# EAGLE schematic motherboard_schematic_ver_1_0 (EAGLE 7.5.0)

## Sheet 1 of 9
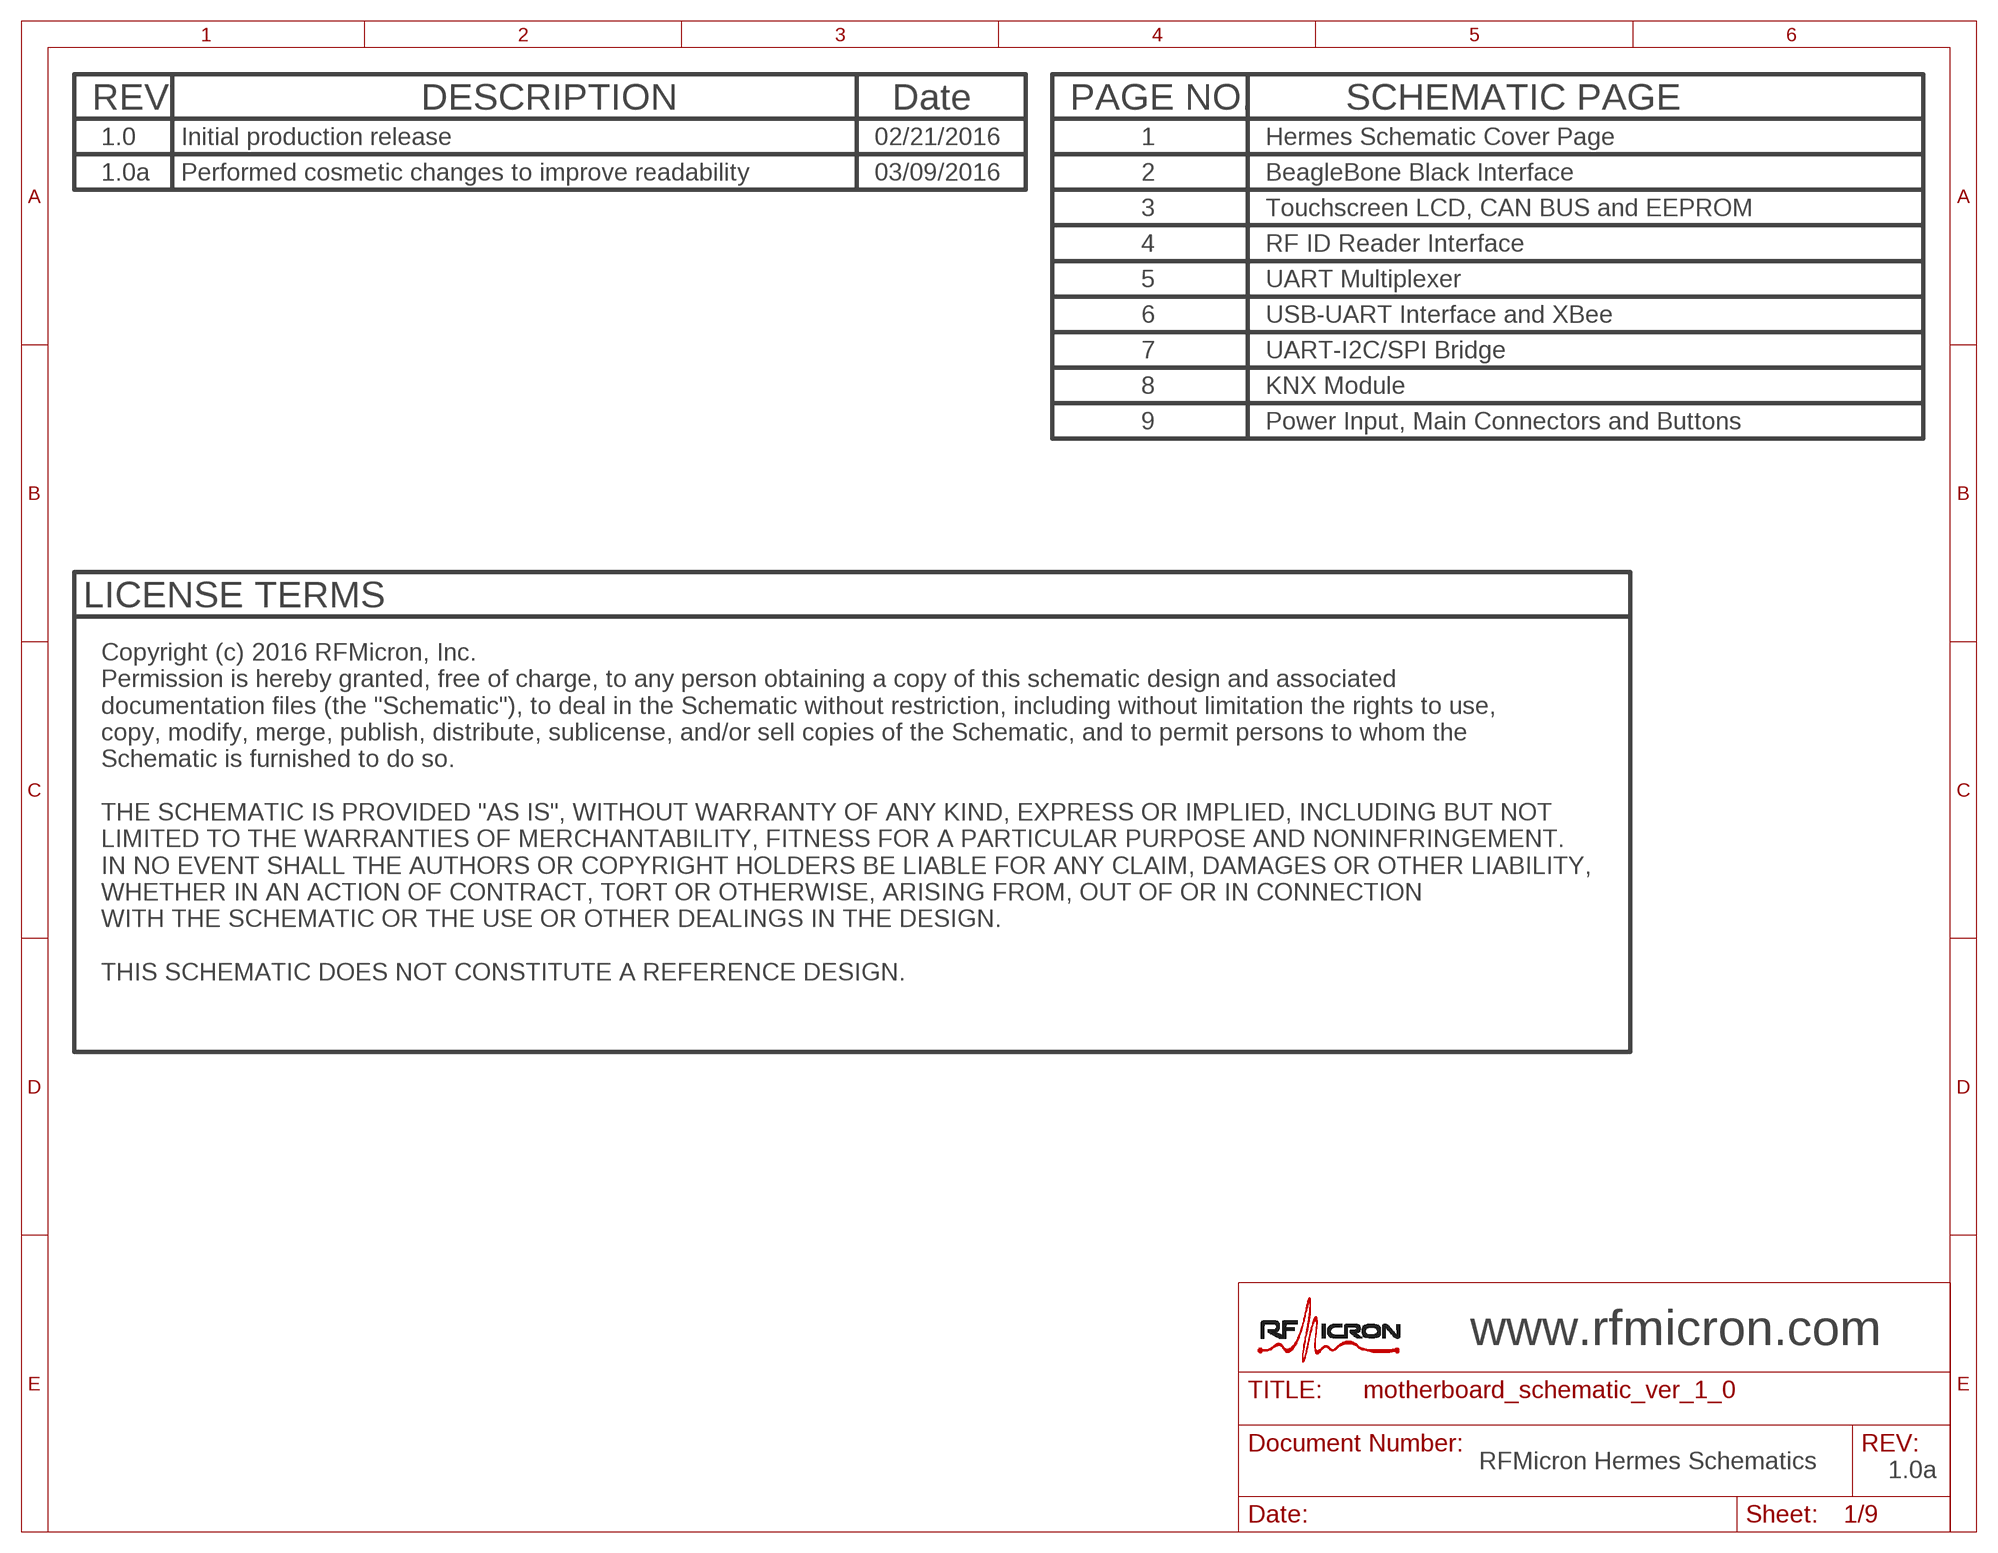
[diagram p0: schematic, sheet 1]

### Notes on the sheet
- REV | DESCRIPTION | Date | PAGE NO. | SCHEMATIC PAGE
- 1.0 | Initial production release | 02/21/2016 | 1 | Hermes Schematic Cover Page
- Performed cosmetic changes to improve readability
- 1.0a | 03/09/2016 | 2 | BeagleBone Black Interface
- 3 | Touchscreen LCD, CAN BUS and EEPROM
- 4 | RF ID Reader Interface
- 5 | UART Multiplexer
- 6 | USB-UART Interface and XBee
- 7 | UART-I2C/SPI Bridge
- 8 | KNX Module
- 9 | Power Input, Main Connectors and Buttons
- LICENSE TERMS
- Copyright (c) 2016 RFMicron, Inc. 
  Permission is hereby granted, free of charge, to any person obtaining a copy of this schematic design and associated
  documentation files (the "Schematic"), to deal in the Schematic without restriction, including without limitation the rights to use, 
  copy, modify, merge, publish, distribute, sublicense, and/or sell copies of the Schematic, and to permit persons to whom the 
  Schematic is furnished to do so.
  
  THE SCHEMATIC IS PROVIDED "AS IS", WITHOUT WARRANTY OF ANY KIND, EXPRESS OR IMPLIED, INCLUDING BUT NOT 
  LIMITED TO THE WARRANTIES OF MERCHANTABILITY, FITNESS FOR A PARTICULAR PURPOSE AND NONINFRINGEMENT. 
  IN NO EVENT SHALL THE AUTHORS OR COPYRIGHT HOLDERS BE LIABLE FOR ANY CLAIM, DAMAGES OR OTHER LIABILITY, 
  WHETHER IN AN ACTION OF CONTRACT, TORT OR OTHERWISE, ARISING FROM, OUT OF OR IN CONNECTION 
  WITH THE SCHEMATIC OR THE USE OR OTHER DEALINGS IN THE DESIGN.
  
  THIS SCHEMATIC DOES NOT CONSTITUTE A REFERENCE DESIGN.
- www.rfmicron.com
- RFMicron Hermes Schematics
- 1.0a

## Sheet 2 of 9
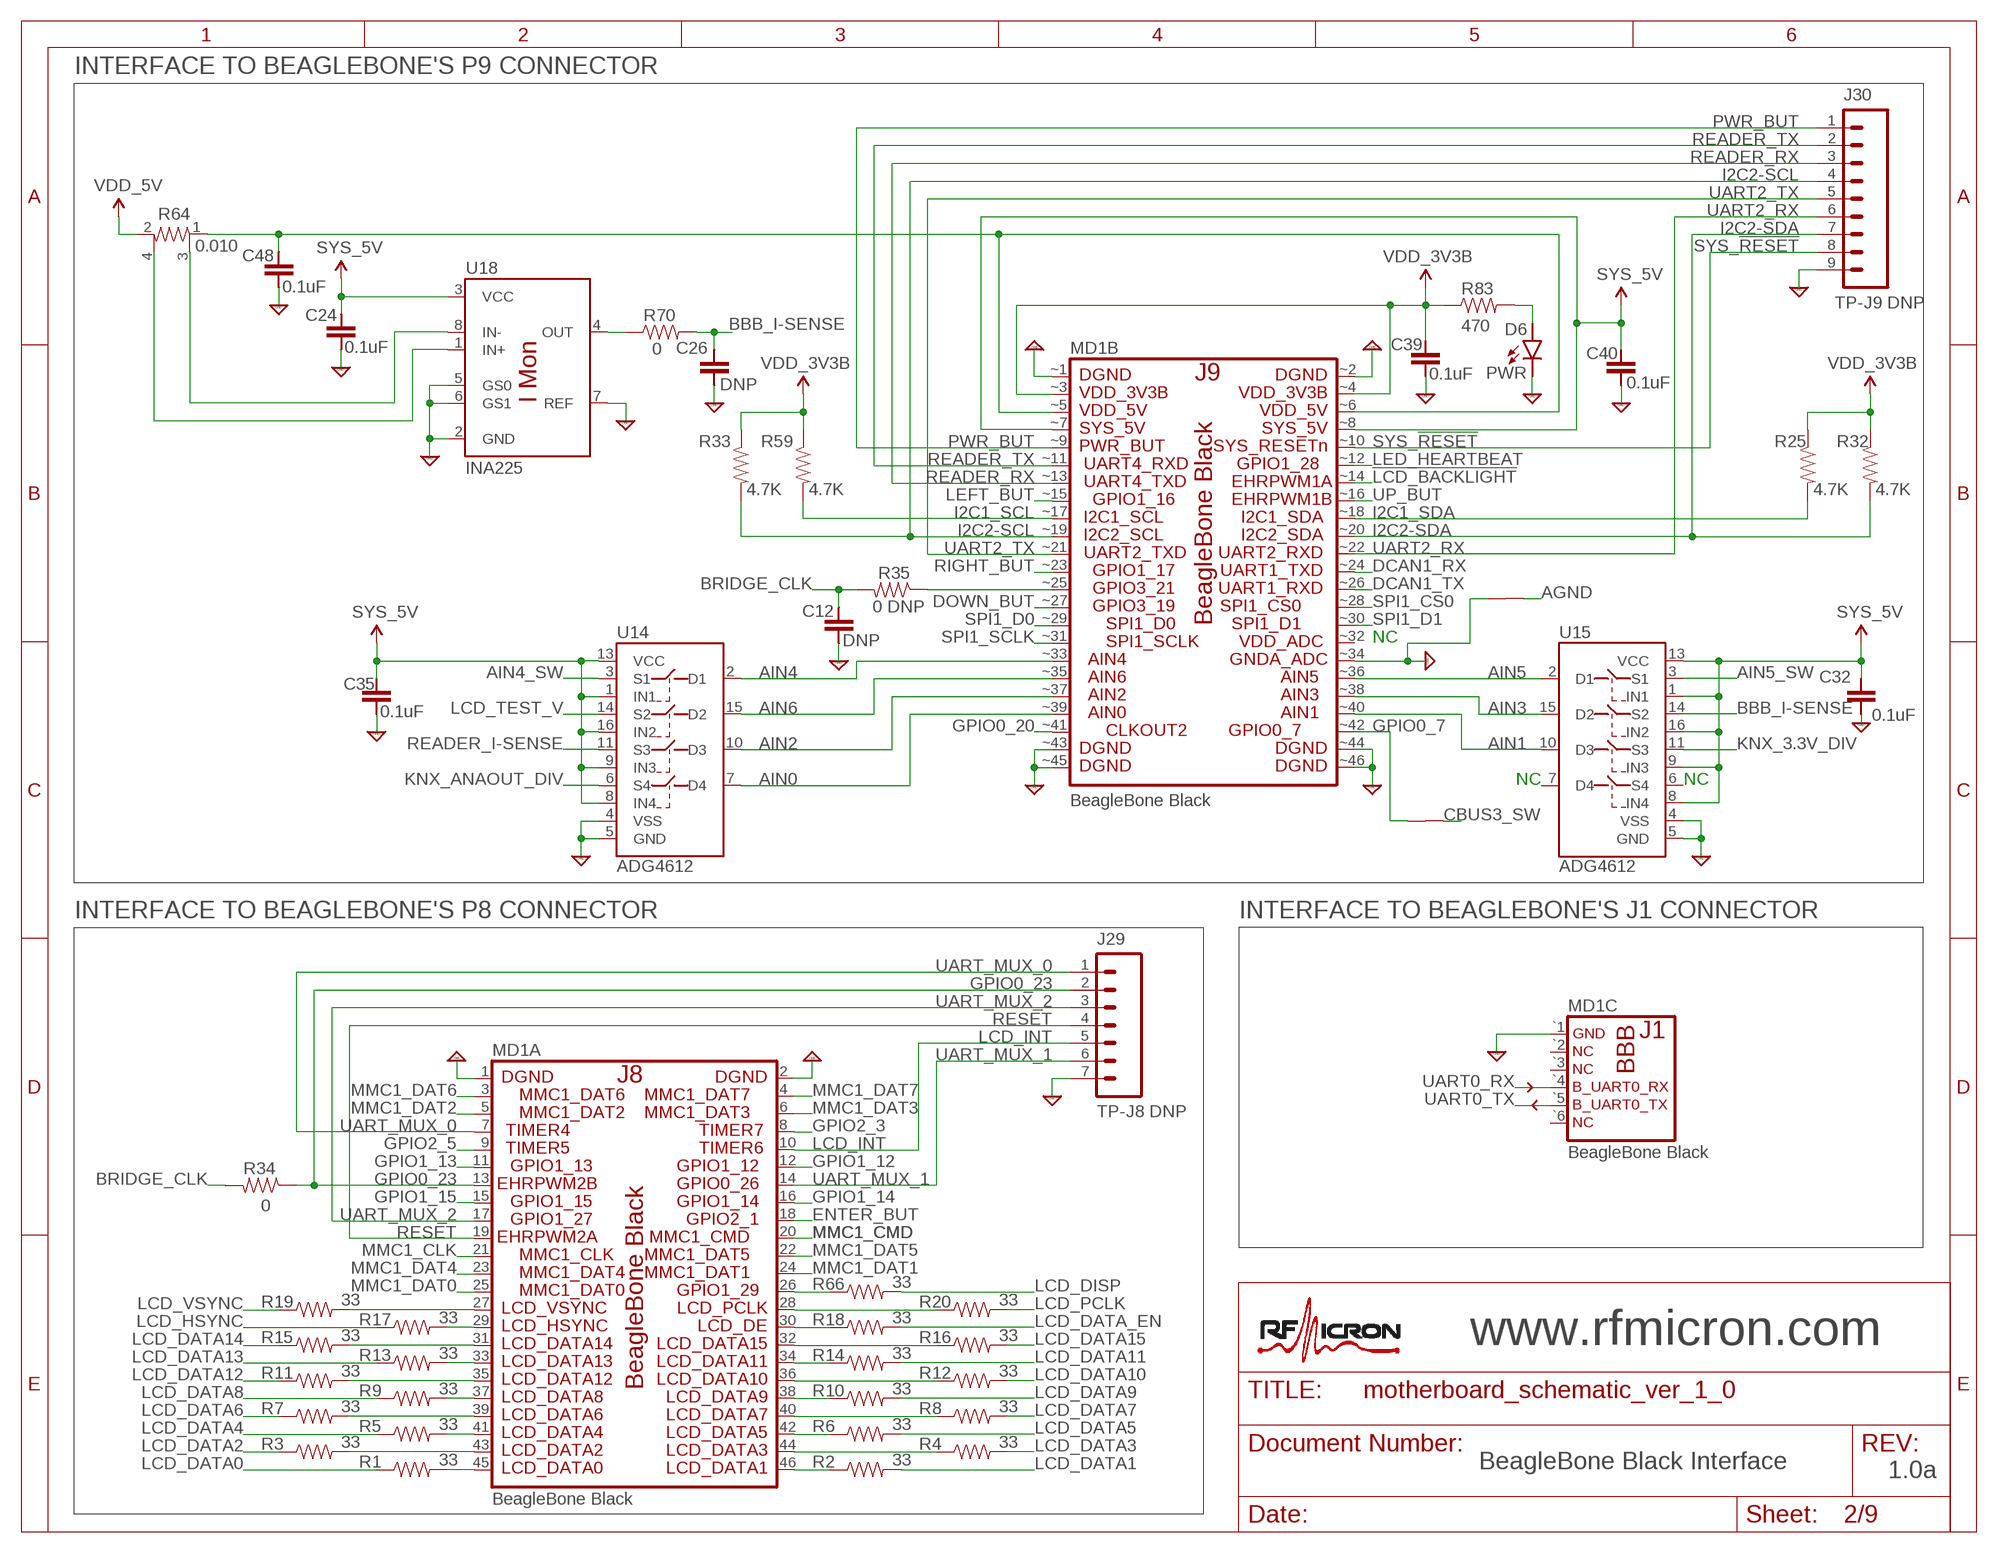
[diagram p1: schematic, sheet 2]

### Parts
C12  DNP  CAP0603  [0603-CAP]
C24  0.1uF  CAP0603  [0603-CAP]
C26  DNP  CAP0603  [0603-CAP]
C32  0.1uF  CAP0603  [0603-CAP]
C35  0.1uF  CAP0603  [0603-CAP]
C39  0.1uF  CAP0603  [0603-CAP]
C40  0.1uF  CAP0603  [0603-CAP]
C48  0.1uF  CAP0603  [0603-CAP]
D6  PWR  LED1206  [LED-1206]
E1  NAMECHANGE  [NAMECHANGE]
E8  NAMECHANGE  [NAMECHANGE]
J29  TP-J8 DNP  M07SP  [1X07-SPECIAL]
J30  TP-J9 DNP  M09SPECIAL  [1X09-SPECIAL]
MD1  BeagleBone Black  BBONE_BKBOT_UP  [BBONE_BK]
R1  33  RESISTOR0603  [0603-RES]
R2  33  RESISTOR0603  [0603-RES]
R3  33  RESISTOR0603  [0603-RES]
R4  33  RESISTOR0603  [0603-RES]
R5  33  RESISTOR0603  [0603-RES]
R6  33  RESISTOR0603  [0603-RES]
R7  33  RESISTOR0603  [0603-RES]
R8  33  RESISTOR0603  [0603-RES]
R9  33  RESISTOR0603  [0603-RES]
R10  33  RESISTOR0603  [0603-RES]
R11  33  RESISTOR0603  [0603-RES]
R12  33  RESISTOR0603  [0603-RES]
R13  33  RESISTOR0603  [0603-RES]
R14  33  RESISTOR0603  [0603-RES]
R15  33  RESISTOR0603  [0603-RES]
R16  33  RESISTOR0603  [0603-RES]
R17  33  RESISTOR0603  [0603-RES]
R18  33  RESISTOR0603  [0603-RES]
R19  33  RESISTOR0603  [0603-RES]
R20  33  RESISTOR0603  [0603-RES]
R25  4.7K  RESISTOR0603  [0603-RES]
R32  4.7K  RESISTOR0603  [0603-RES]
R33  4.7K  RESISTOR0603  [0603-RES]
R34  0  RESISTOR0603  [0603-RES]
R35  0 DNP  RESISTOR0603  [0603-RES]
R59  4.7K  RESISTOR0603  [0603-RES]
R64  0.010  RESISTOR_4-TERM1  [RESIST_4-TERM_VISHAY]
R66  33  RESISTOR0603  [0603-RES]
R70  0  RESISTOR0603  [0603-RES]
R83  470  RESISTOR0603  [0603-RES]
U14  ADG4612  [TSSOP16]
U15  ADG4612  [TSSOP16]
U18  INA225  [MSOP8]

### Nets
!LCD_BACKLIGHT: MD1.~14 ; also sheet 3
AGND: E1.2 ; also sheet 9
AIN0: MD1.~39 U14.7(D4)
AIN1: MD1.~40 U15.10(D3)
AIN2: MD1.~37 U14.10(D3)
AIN3: MD1.~38 U15.15(D2)
AIN4: MD1.~33 U14.2(D1)
AIN4_SW: U14.3(S1) ; also sheet 9
AIN5: MD1.~36 U15.2(D1)
AIN5_SW: U15.3(S1) ; also sheet 9
AIN6: MD1.~35 U14.15(D2)
BBB_I-SENSE: C26.1(+) R70.2 U15.14(S2)
BBB_I-SENSE+: R64.4 U18.1(IN+)
BBB_I-SENSE-: R64.3 U18.8(IN-)
BRIDGE_CLK: C12.1(+) R34.2 R35.2 ; also sheet 7
CBUS3_SW: E8.1 ; also sheet 6
DCAN1_RX: MD1.~24 ; also sheet 3,9
DCAN1_TX: MD1.~26 ; also sheet 3,9
DOWN_BUT: MD1.~27 ; also sheet 9
ENTER_BUT: MD1.18 ; also sheet 9
GND: C12.2(-) C24.1(+) C26.2(-) C32.2(-) C35.2(-) C39.2(-) C40.2(-) C48.2(-) D6.C E1.1 J29.7 J30.9 MD1.1 MD1.2 MD1.`1 MD1.~1 MD1.~2 MD1.~34 MD1.~43 MD1.~44 MD1.~45 MD1.~46 U14.4(VSS) U14.5(GND) U15.4(VSS) U15.5(GND) U18.2(GND) U18.5(GS0) U18.6(GS1) U18.7(REF) ; also sheet 3,4,5,6,7,8,9
GPIO0_7: E8.2 MD1.~42 ; also sheet 4,9
GPIO0_20: MD1.~41 ; also sheet 6,9
GPIO0_23: J29.2 MD1.13 R34.1
GPIO1_12: MD1.12 ; also sheet 3,9
GPIO1_13: MD1.11 ; also sheet 3,7,9
GPIO1_14: MD1.16 ; also sheet 8,9
GPIO1_15: MD1.15 ; also sheet 8,9
GPIO2_3: MD1.8 ; also sheet 6,9
GPIO2_5: MD1.9 ; also sheet 3,9
I2C1_SCL: MD1.~17 R59.2 ; also sheet 7,9
I2C1_SDA: MD1.~18 R25.2 ; also sheet 7,9
I2C2-SCL: J30.4 MD1.~19 R33.2 ; also sheet 3
I2C2-SDA: J30.7 MD1.~20 R32.2 ; also sheet 3
KNX_3.3V_DIV: U15.11(S3) ; also sheet 8
KNX_ANAOUT_DIV: U14.6(S4) ; also sheet 8
LCD_DATA0: R1.1 ; also sheet 3
LCD_DATA1: R2.2 ; also sheet 3
LCD_DATA2: R3.1 ; also sheet 3
LCD_DATA3: R4.2 ; also sheet 3
LCD_DATA4: R5.1 ; also sheet 3
LCD_DATA5: R6.2 ; also sheet 3
LCD_DATA6: R7.1 ; also sheet 3
LCD_DATA7: R8.2 ; also sheet 3
LCD_DATA8: R9.1 ; also sheet 3
LCD_DATA9: R10.2 ; also sheet 3
LCD_DATA10: R12.2 ; also sheet 3
LCD_DATA11: R14.2 ; also sheet 3
LCD_DATA12: R11.1 ; also sheet 3
LCD_DATA13: R13.1 ; also sheet 3
LCD_DATA14: R15.1 ; also sheet 3
LCD_DATA15: R16.2 ; also sheet 3
LCD_DATA_EN: R18.2 ; also sheet 3
LCD_DISP: R66.2 ; also sheet 3
LCD_HSYNC: R17.1 ; also sheet 3
LCD_INT: J29.5 MD1.10 ; also sheet 3
LCD_PCLK: R20.2 ; also sheet 3
LCD_TEST_V: U14.14(S2) ; also sheet 3
LCD_VSYNC: R19.1 ; also sheet 3
LED_HEARTBEAT: MD1.~12 ; also sheet 9
LEFT_BUT: MD1.~15 ; also sheet 9
MMC1_CLK: MD1.21 ; also sheet 9
MMC1_CMD: MD1.20 ; also sheet 9
MMC1_DAT0: MD1.25 ; also sheet 9
MMC1_DAT1: MD1.24 ; also sheet 9
MMC1_DAT2: MD1.5 ; also sheet 9
MMC1_DAT3: MD1.6 ; also sheet 9
MMC1_DAT4: MD1.23 ; also sheet 9
MMC1_DAT5: MD1.22 ; also sheet 9
MMC1_DAT6: MD1.3 ; also sheet 9
MMC1_DAT7: MD1.4 ; also sheet 9
N$1: MD1.46 R2.1
N$2: MD1.44 R4.1
N$3: MD1.42 R6.1
N$4: MD1.40 R8.1
N$5: MD1.38 R10.1
N$6: MD1.36 R12.1
N$7: MD1.34 R14.1
N$8: MD1.32 R16.1
N$9: MD1.30 R18.1
N$10: MD1.28 R20.1
N$11: MD1.45 R1.2
N$12: MD1.43 R3.2
N$13: MD1.41 R5.2
N$14: MD1.39 R7.2
N$15: MD1.37 R9.2
N$16: MD1.35 R11.2
N$17: MD1.33 R13.2
N$18: MD1.31 R15.2
N$19: MD1.29 R17.2
N$20: MD1.27 R19.2
N$36: MD1.26 R66.1
N$78: MD1.~25 R35.1
N$98: R70.1 U18.4(OUT)
N$101: D6.A R83.2
PWR_BUT: J30.1 MD1.~9 ; also sheet 9
READER_I-SENSE: U14.11(S3) ; also sheet 4
READER_RX: J30.3 MD1.~13 ; also sheet 4,9
READER_TX: J30.2 MD1.~11 ; also sheet 4,9
RESET: J29.4 MD1.19 ; also sheet 6,7
RIGHT_BUT: MD1.~23 ; also sheet 9
SPI1_CS0: MD1.~28 ; also sheet 9
SPI1_D0: MD1.~29 ; also sheet 9
SPI1_D1: MD1.~30 ; also sheet 9
SPI1_SCLK: MD1.~31 ; also sheet 9
SYS_5V: C24.2(-) C32.1(+) C35.1(+) C40.1(+) MD1.~7 MD1.~8 U14.1(IN1) U14.8(IN4) U14.9(IN3) U14.13(VCC) U14.16(IN2) U15.1(IN1) U15.8(IN4) U15.9(IN3) U15.13(VCC) U15.16(IN2) U18.3(VCC) ; also sheet 3,4,9
SYS_!RESET: J30.8 MD1.~10 ; also sheet 9
UART0_RX: MD1.`4 ; also sheet 6
UART0_TX: MD1.`5 ; also sheet 6
UART2_RX: J30.6 MD1.~22 ; also sheet 5
UART2_TX: J30.5 MD1.~21 ; also sheet 5
UART_MUX_0: J29.1 MD1.7 ; also sheet 5
UART_MUX_1: J29.6 MD1.14 ; also sheet 5
UART_MUX_2: J29.3 MD1.17 ; also sheet 5
UP_BUT: MD1.~16 ; also sheet 9
VDD_3V3B: C39.1(+) MD1.~3 MD1.~4 R25.1 R32.1 R33.1 R59.1 R83.1 ; also sheet 3,4,5,6,7,8,9
VDD_5V: R64.2 ; also sheet 4,9
VDD_5V`: C48.1(+) MD1.~5 MD1.~6 R64.1
Unconnected: MD1.`2 MD1.`3 MD1.`6 MD1.~32 U15.6(S4) U15.7(D4)

### Notes on the sheet
- INTERFACE TO BEAGLEBONE'S P9 CONNECTOR
- NC
- NC | NC
- INTERFACE TO BEAGLEBONE'S P8 CONNECTOR | INTERFACE TO BEAGLEBONE'S J1 CONNECTOR
- www.rfmicron.com
- BeagleBone Black Interface
- 1.0a

## Sheet 3 of 9
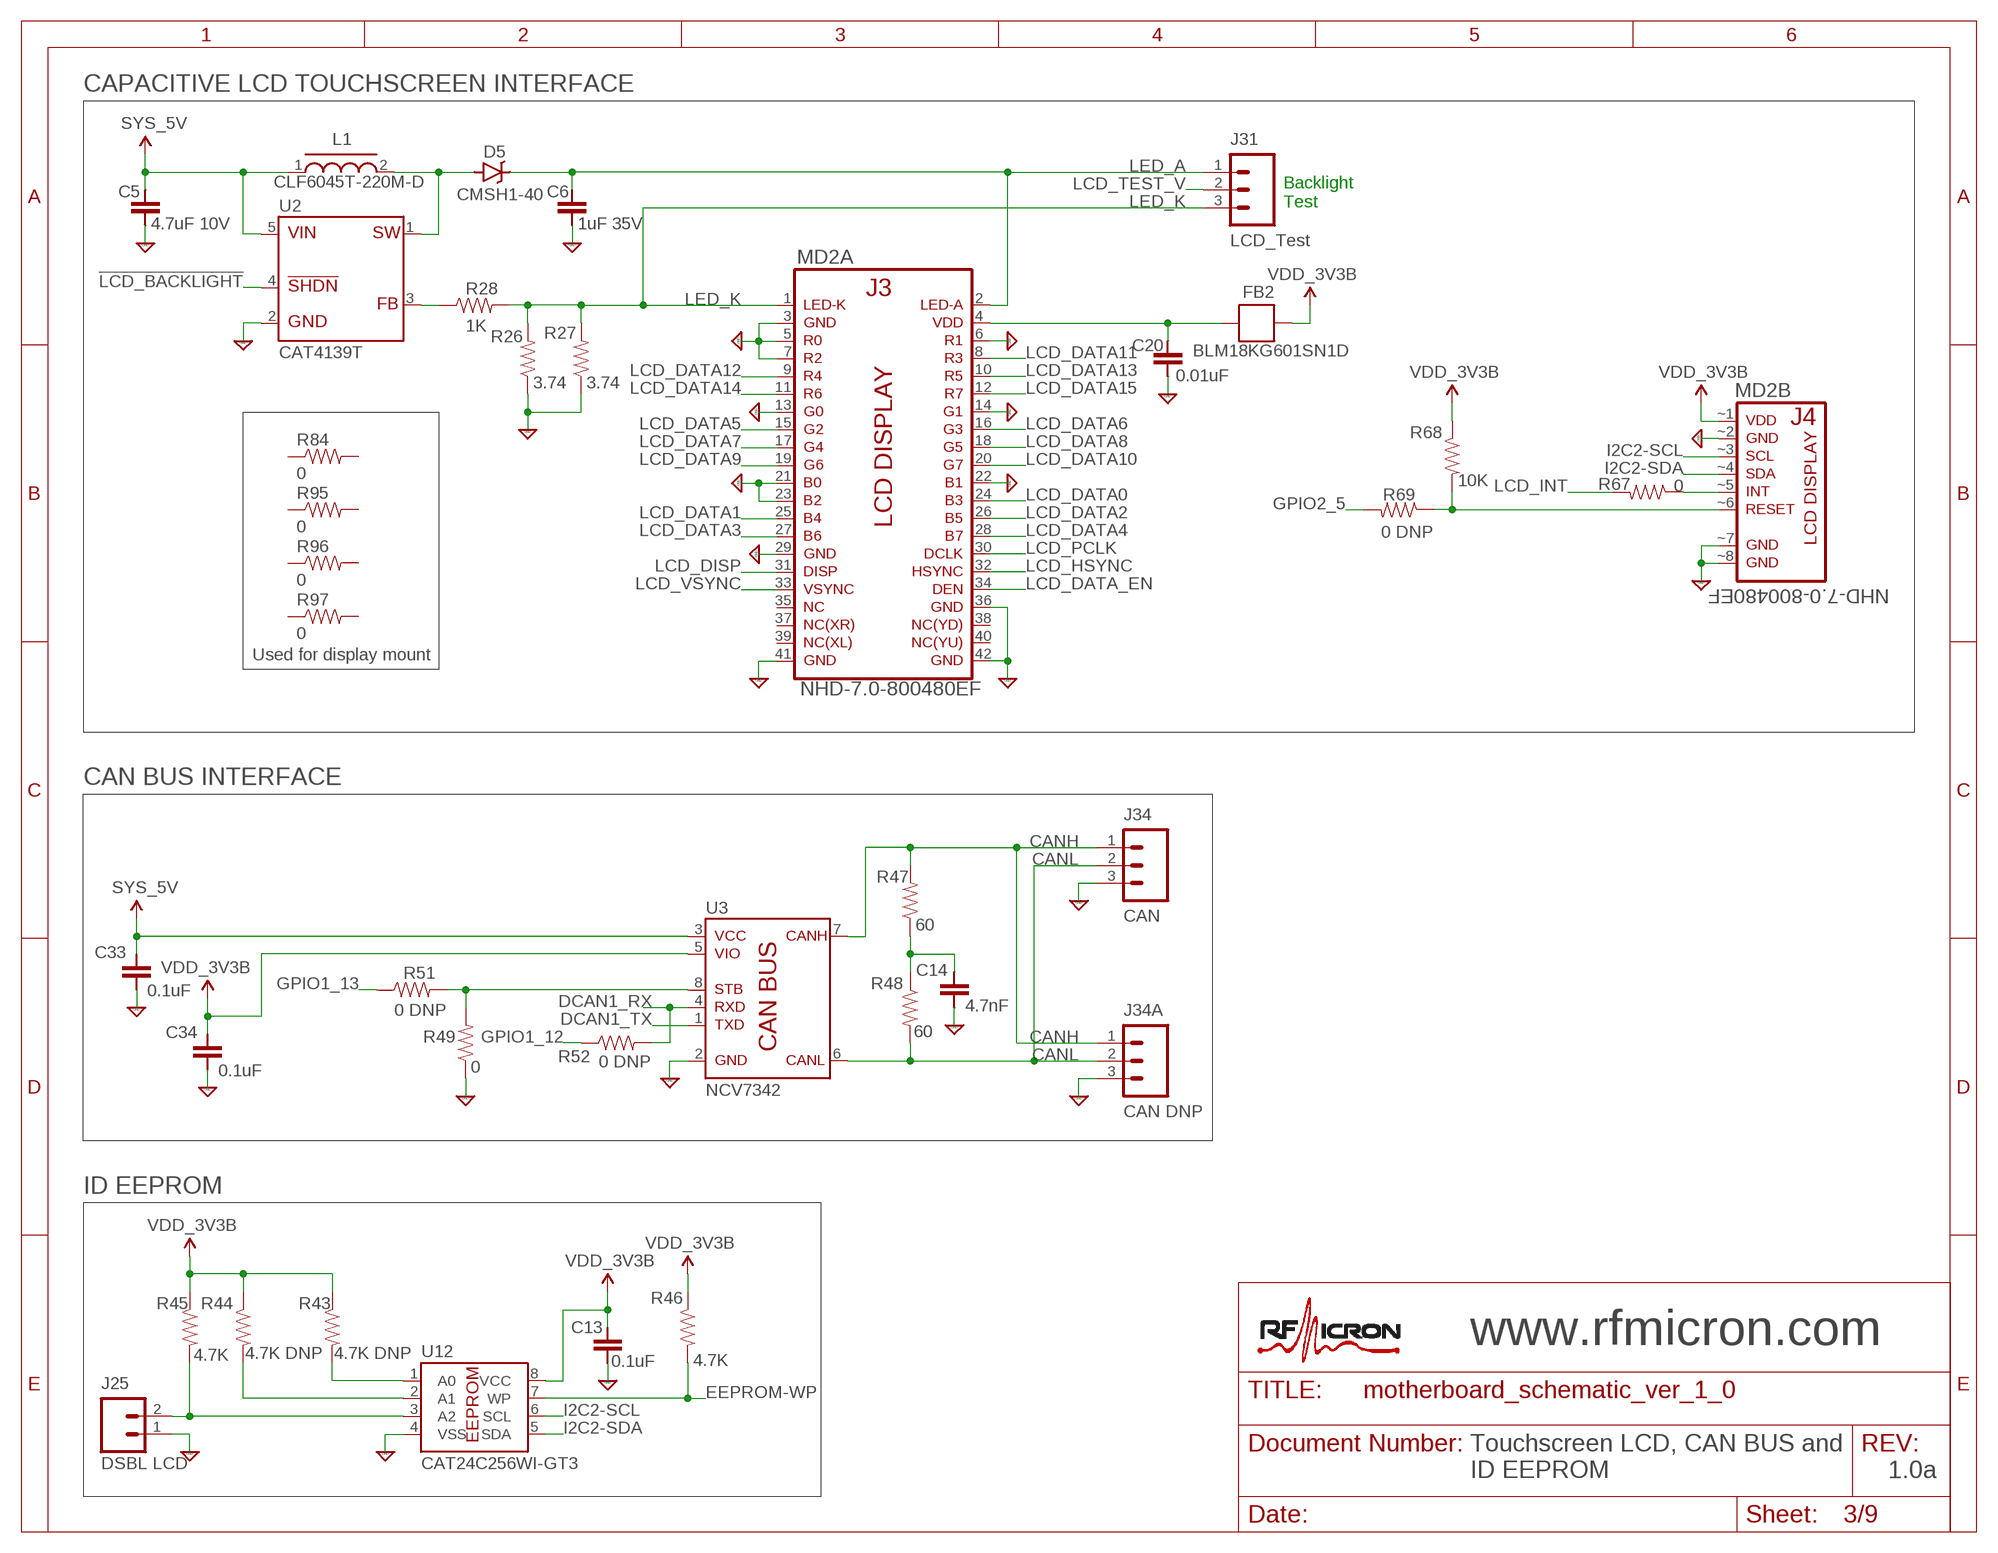
[diagram p2: schematic, sheet 3]

### Parts
C5  4.7uF 10V  CAP0603  [0603-CAP]
C6  1uF 35V  CAP0603  [0603-CAP]
C13  0.1uF  CAP0603  [0603-CAP]
C14  4.7nF  CAP0603  [0603-CAP]
C20  0.01uF  CAP0603  [0603-CAP]
C33  0.1uF  CAP0603  [0603-CAP]
C34  0.1uF  CAP0603  [0603-CAP]
D5  CMSH1-40  DIODE-SCHOTTKY1  [SMB-DIODE]
FB2  BLM18KG601SN1D  FERRITEBEAD  [0603]
J25  DSBL LCD  M02ASM  [1X2SM]
J31  LCD_Test  M03SP  [1X03-SPECIAL]
J34  CAN  M03PH  [PHOENIX1725669-3]
J34A  CAN DNP  M03SP  [1X03-SPECIAL]
L1  CLF6045T-220M-D  TDK-CA_INDUCT  [TDK_CA]
MD2  NHD-7.0-800480EF  NEWHAVEN_LCD_NHD-7.0-800480EF  [NEWHAVEN_LCD_NHD-7.0-800480EF]
R26  3.74  RESISTOR0603  [0603-RES]
R27  3.74  RESISTOR0603  [0603-RES]
R28  1K  RESISTOR0603  [0603-RES]
R43  4.7K DNP  RESISTOR0603  [0603-RES]
R44  4.7K DNP  RESISTOR0603  [0603-RES]
R45  4.7K  RESISTOR0603  [0603-RES]
R46  4.7K  RESISTOR0603  [0603-RES]
R47  60  RESISTOR0603  [0603-RES]
R48  60  RESISTOR0603  [0603-RES]
R49  0  RESISTOR0603  [0603-RES]
R51  0 DNP  RESISTOR0603  [0603-RES]
R52  0 DNP  RESISTOR0603  [0603-RES]
R67  0  RESISTOR0603  [0603-RES]
R68  10K  RESISTOR0603  [0603-RES]
R69  0 DNP  RESISTOR0603  [0603-RES]
R84  0  RESISTOR0805  [0805-RES]
R95  0  RESISTOR0805  [0805-RES]
R96  0  RESISTOR0805  [0805-RES]
R97  0  RESISTOR0805  [0805-RES]
U2  CAT4139T  [TSOT-23-5]
U3  NCV7342  [SOIC08]
U12  CAT24C256WI-GT3  EEPROM-I2CSMD  [SO08]

### Nets
!LCD_BACKLIGHT: U2.4(!SHDN) ; also sheet 2
CANH: J34.1 J34A.1 R47.2 U3.7(CANH)
CANL: J34.2 J34A.2 R48.2 U3.6(CANL)
DCAN1_RX: R52.2 U3.4(RXD) ; also sheet 2,9
DCAN1_TX: U3.1(TXD) ; also sheet 2,9
EEPROM-WP: R46.2 U12.7(WP) ; also sheet 9
GND: C5.2(-) C6.2(-) C13.2(-) C14.2(-) C20.2(-) C33.2(-) C34.2(-) J25.1 J34.3 J34A.3 MD2.3 MD2.5 MD2.6 MD2.7 MD2.13 MD2.14 MD2.21 MD2.22 MD2.23 MD2.29 MD2.36 MD2.41 MD2.42 MD2.~2 MD2.~7 MD2.~8 R26.1 R27.1 R49.1 U2.2(GND) U3.2(GND) U12.4(VSS) ; also sheet 2,4,5,6,7,8,9
GPIO1_12: R52.1 ; also sheet 2,9
GPIO1_13: R51.1 ; also sheet 2,7,9
GPIO2_5: R69.2 ; also sheet 2,9
I2C2-SCL: MD2.~3 U12.6(SCL) ; also sheet 2
I2C2-SDA: MD2.~4 U12.5(SDA) ; also sheet 2
LCD_DATA0: MD2.24 ; also sheet 2
LCD_DATA1: MD2.25 ; also sheet 2
LCD_DATA2: MD2.26 ; also sheet 2
LCD_DATA3: MD2.27 ; also sheet 2
LCD_DATA4: MD2.28 ; also sheet 2
LCD_DATA5: MD2.15 ; also sheet 2
LCD_DATA6: MD2.16 ; also sheet 2
LCD_DATA7: MD2.17 ; also sheet 2
LCD_DATA8: MD2.18 ; also sheet 2
LCD_DATA9: MD2.19 ; also sheet 2
LCD_DATA10: MD2.20 ; also sheet 2
LCD_DATA11: MD2.8 ; also sheet 2
LCD_DATA12: MD2.9 ; also sheet 2
LCD_DATA13: MD2.10 ; also sheet 2
LCD_DATA14: MD2.11 ; also sheet 2
LCD_DATA15: MD2.12 ; also sheet 2
LCD_DATA_EN: MD2.34 ; also sheet 2
LCD_DISP: MD2.31 ; also sheet 2
LCD_HSYNC: MD2.32 ; also sheet 2
LCD_INT: R67.2 ; also sheet 2
LCD_PCLK: MD2.30 ; also sheet 2
LCD_TEST_V: J31.2 ; also sheet 2
LCD_VSYNC: MD2.33 ; also sheet 2
LED_A: C6.1(+) D5.C J31.1 MD2.2
LED_K: J31.3 MD2.1 R26.2 R27.2 R28.2
N$34: R43.2 U12.1(A0)
N$37: D5.A L1.2 U2.1(SW)
N$38: R44.2 U12.2(A1)
N$39: J25.2 R45.2 U12.3(A2)
N$41: R28.1 U2.3(FB)
N$48: C14.1(+) R47.1 R48.1
N$84: R49.2 R51.2 U3.8(STB)
N$93: C20.1(+) FB2.2 MD2.4
N$95: MD2.~6 R68.2 R69.1
N$97: MD2.~5 R67.1
SYS_5V: C5.1(+) C33.1(+) L1.1 U2.5(VIN) U3.3(VCC) ; also sheet 2,4,9
VDD_3V3B: C13.1(+) C34.1(+) FB2.1 MD2.~1 R43.1 R44.1 R45.1 R46.1 R68.1 U3.5(VIO) U12.8(VCC) ; also sheet 2,4,5,6,7,8,9
Unconnected: MD2.35 MD2.37 MD2.38 MD2.39 MD2.40 R84.1 R84.2 R95.1 R95.2 R96.1 R96.2 R97.1 R97.2

### Notes on the sheet
- CAPACITIVE LCD TOUCHSCREEN INTERFACE
- Backlight
  Test
- Used for display mount
- CAN BUS INTERFACE
- ID EEPROM
- www.rfmicron.com
- Touchscreen LCD, CAN BUS and 
  ID EEPROM
- 1.0a

## Sheet 4 of 9
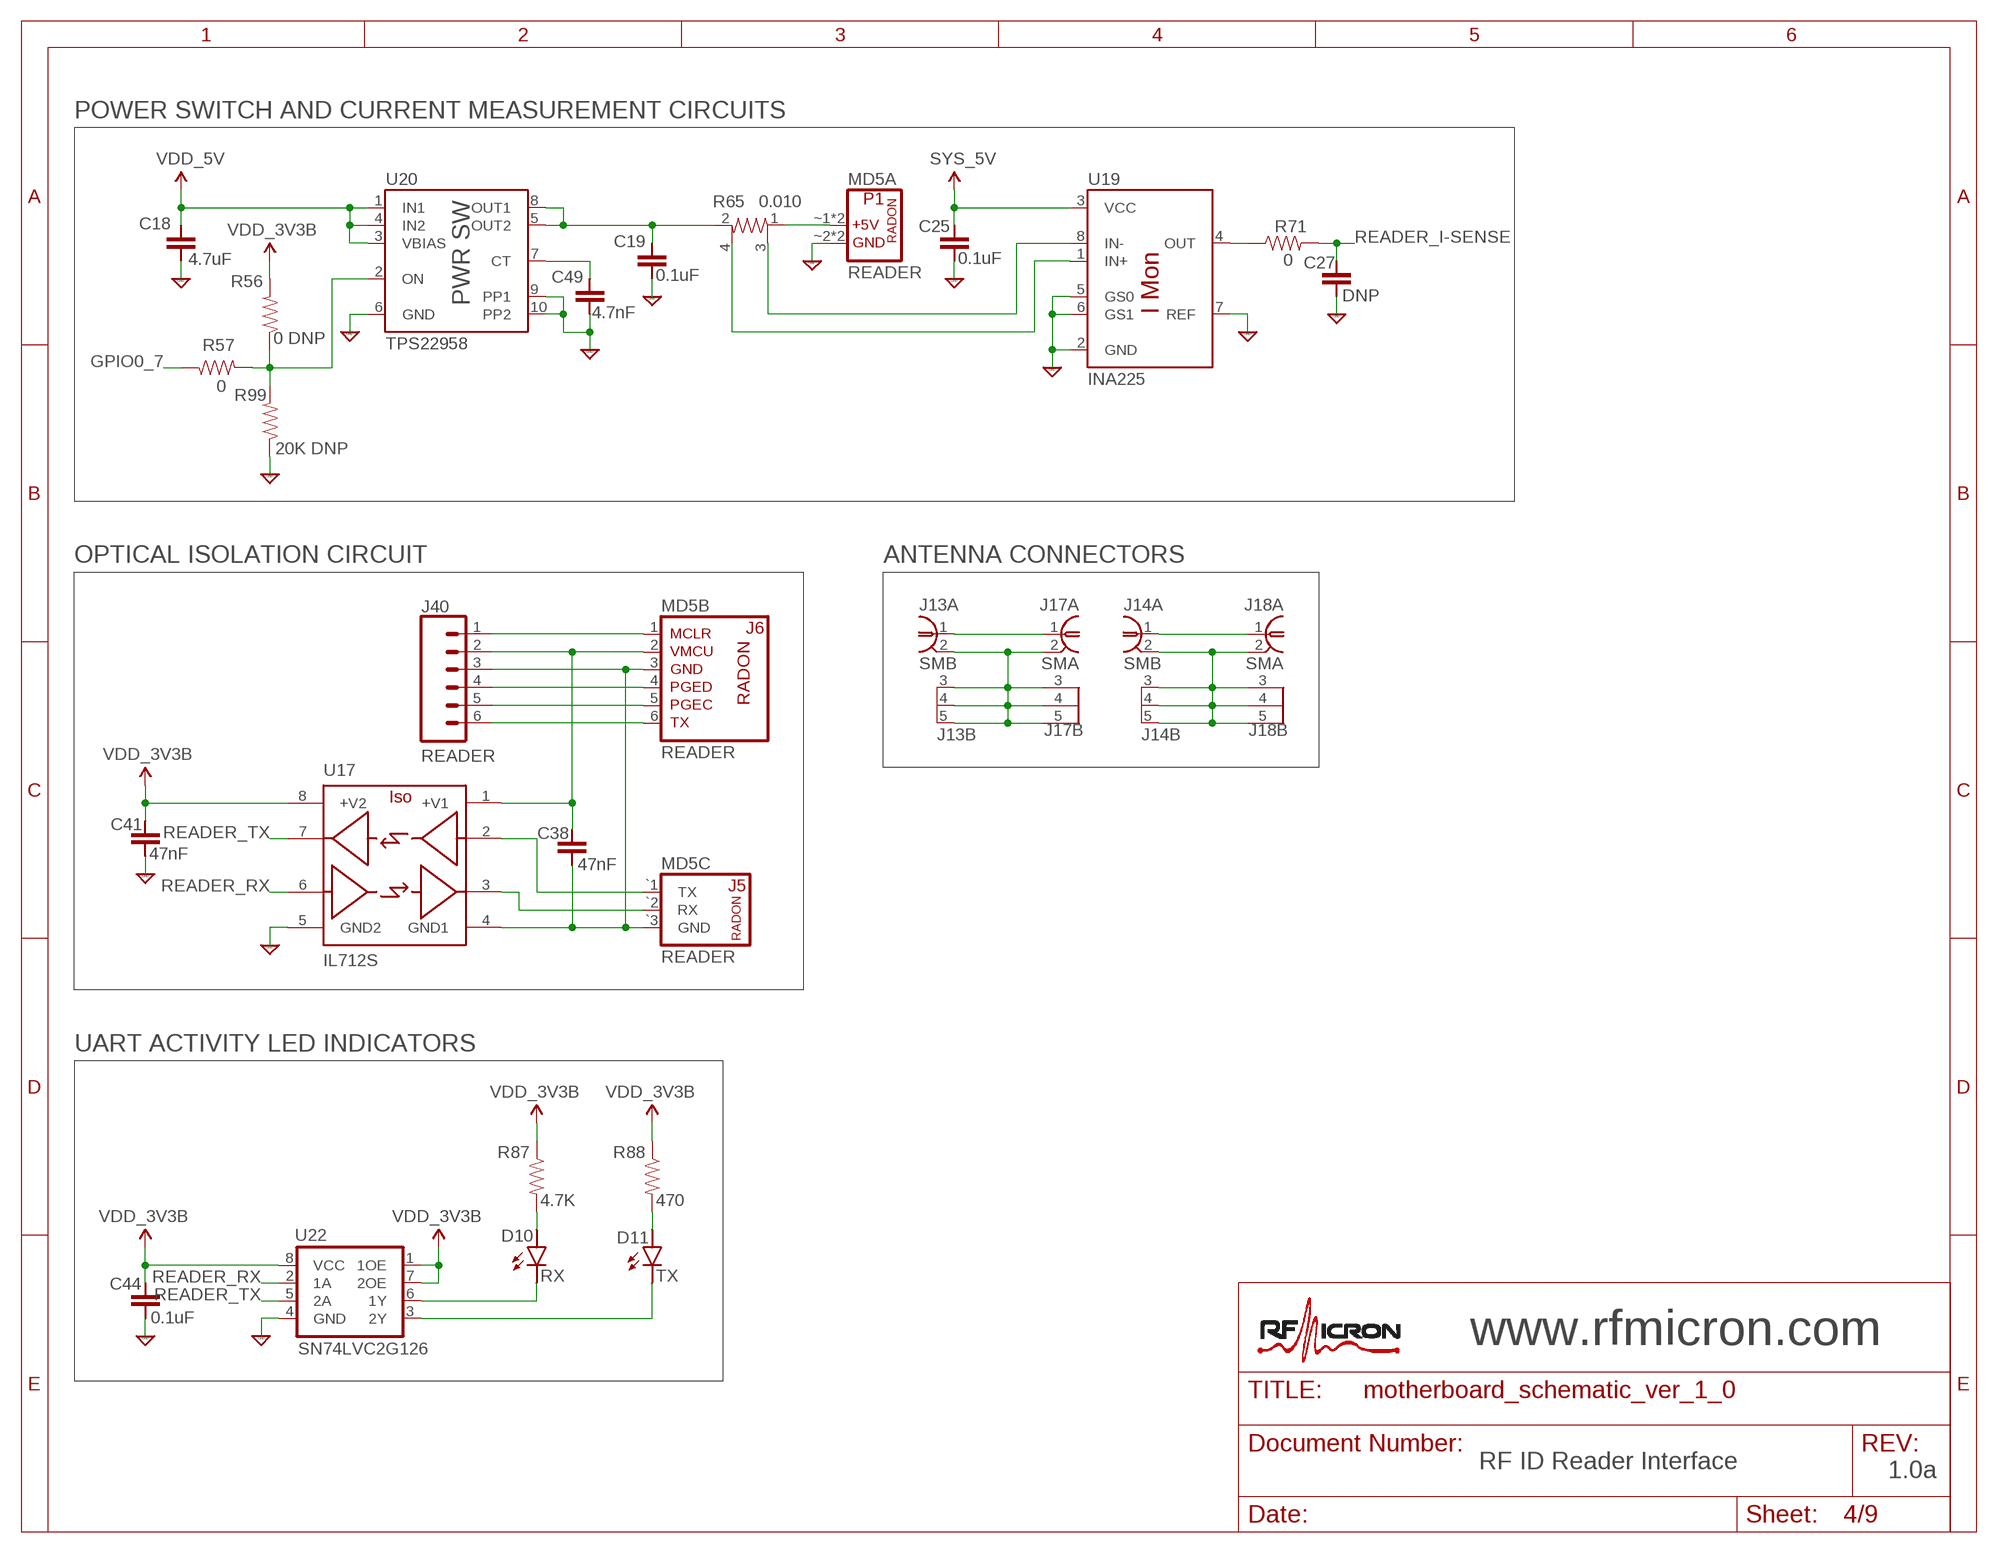
[diagram p3: schematic, sheet 4]

### Parts
C18  4.7uF  CAP0603  [0603-CAP]
C19  0.1uF  CAP0603  [0603-CAP]
C25  0.1uF  CAP0603  [0603-CAP]
C27  DNP  CAP0603  [0603-CAP]
C38  47nF  CAP0603  [0603-CAP]
C41  47nF  CAP0603  [0603-CAP]
C44  0.1uF  CAP0603  [0603-CAP]
C49  4.7nF  CAP0603  [0603-CAP]
D10  RX  LED1206  [LED-1206]
D11  TX  LED1206  [LED-1206]
J13  SMB  SMB-SMDA  [SMB-SMD]
J14  SMB  SMB-SMDA  [SMB-SMD]
J17  SMA  BNC-SMA-EDGESMA-ONLY  [SMA-EDGE]
J18  SMA  BNC-SMA-EDGESMA-ONLY  [SMA-EDGE]
J40  READER  M06SIP  [1X06]
MD5  READER  RADON_RFID_READ  [RADON_RFID_READ]
R56  0 DNP  RESISTOR0603  [0603-RES]
R57  0  RESISTOR0603  [0603-RES]
R65  0.010  RESISTOR_4-TERM1  [RESIST_4-TERM_VISHAY]
R71  0  RESISTOR0603  [0603-RES]
R87  4.7K  RESISTOR0603  [0603-RES]
R88  470  RESISTOR0603  [0603-RES]
R99  20K DNP  RESISTOR0603  [0603-RES]
U17  IL712S  [SOIC08]
U19  INA225  [MSOP8]
U20  TPS22958  TPS22958POWERSWITCH  [MSOP8-POWERPAD]
U22  SN74LVC2G126  SN74LVC2G126-ALTA  [SM8-TI-A]

### Nets
GND: C18.2(-) C19.2(-) C25.1(+) C27.2(-) C41.2(-) C44.1(+) C49.2(-) MD5.~2 MD5.~4 R99.1 U17.5(GND2) U19.2(GND) U19.5(GS0) U19.6(GS1) U19.7(REF) U20.6(GND) U20.9(PP1) U20.10(PP2) U22.4(GND) ; also sheet 2,3,5,6,7,8,9
GND_RF: J13.2(A:GND) J13.3(B:GND) J13.4(B:GND) J13.5(B:GND) J17.2(A:GND) J17.3(B:GND) J17.4(B:GND) J17.5(B:GND)
GPIO0_7: R57.1 ; also sheet 2,9
N$21: J13.1 J17.1
N$26: J14.1 J18.1
N$33: J40.1 MD5.1
N$58: J14.2(A:GND) J14.3(B:GND) J14.4(B:GND) J14.5(B:GND) J18.2(A:GND) J18.3(B:GND) J18.4(B:GND) J18.5(B:GND)
N$68: J40.4 MD5.4
N$69: J40.5 MD5.5
N$71: C49.1(+) U20.7(CT)
N$81: J40.6 MD5.6
N$82: C38.2(-) J40.3 MD5.3 MD5.`3(C:GND) U17.4(GND1)
N$83: MD5.`2(C:RX) U17.3(OUT2)
N$85: MD5.`1(C:TX) U17.2(IN1)
N$86: D10.A R87.2
N$87: D11.A R88.2
N$88: R56.1 R57.2 R99.2 U20.2(ON)
N$92: D10.C U22.6(1Y)
N$94: C38.1(+) J40.2 MD5.2(B:VMCU) U17.1(+V1)
N$96: D11.C U22.3(2Y)
N$99: R71.1 U19.4(OUT)
READER_I-SENSE: C27.1(+) R71.2 ; also sheet 2
READER_I-SENSE+: R65.4 U19.1(IN+)
READER_I-SENSE-: R65.3 U19.8(IN-)
READER_RX: U17.6(IN2) U22.2(1A) ; also sheet 2,9
READER_TX: U17.7(OUT1) U22.5(2A) ; also sheet 2,9
SYS_5V: C25.2(-) U19.3(VCC) ; also sheet 2,3,9
VDD_3V3B: C41.1(+) C44.2(-) R56.2 R87.1 R88.1 U17.8(+V2) U22.1(1OE) U22.7(2OE) U22.8(VCC) ; also sheet 2,3,5,6,7,8,9
VDD_5V: C18.1(+) U20.1(IN1) U20.3(VBIAS) U20.4(IN2) ; also sheet 2,9
VDD_5V-SW: MD5.~1 MD5.~3 R65.1
VDD_5V-SW`: C19.1(+) R65.2 U20.5(OUT2) U20.8(OUT1)
Unconnected: MD5.P$1(D:H1) MD5.P$2(D:H2)

### Notes on the sheet
- POWER SWITCH AND CURRENT MEASUREMENT CIRCUITS
- OPTICAL ISOLATION CIRCUIT | ANTENNA CONNECTORS
- UART ACTIVITY LED INDICATORS
- www.rfmicron.com
- RF ID Reader Interface
- 1.0a

## Sheet 5 of 9
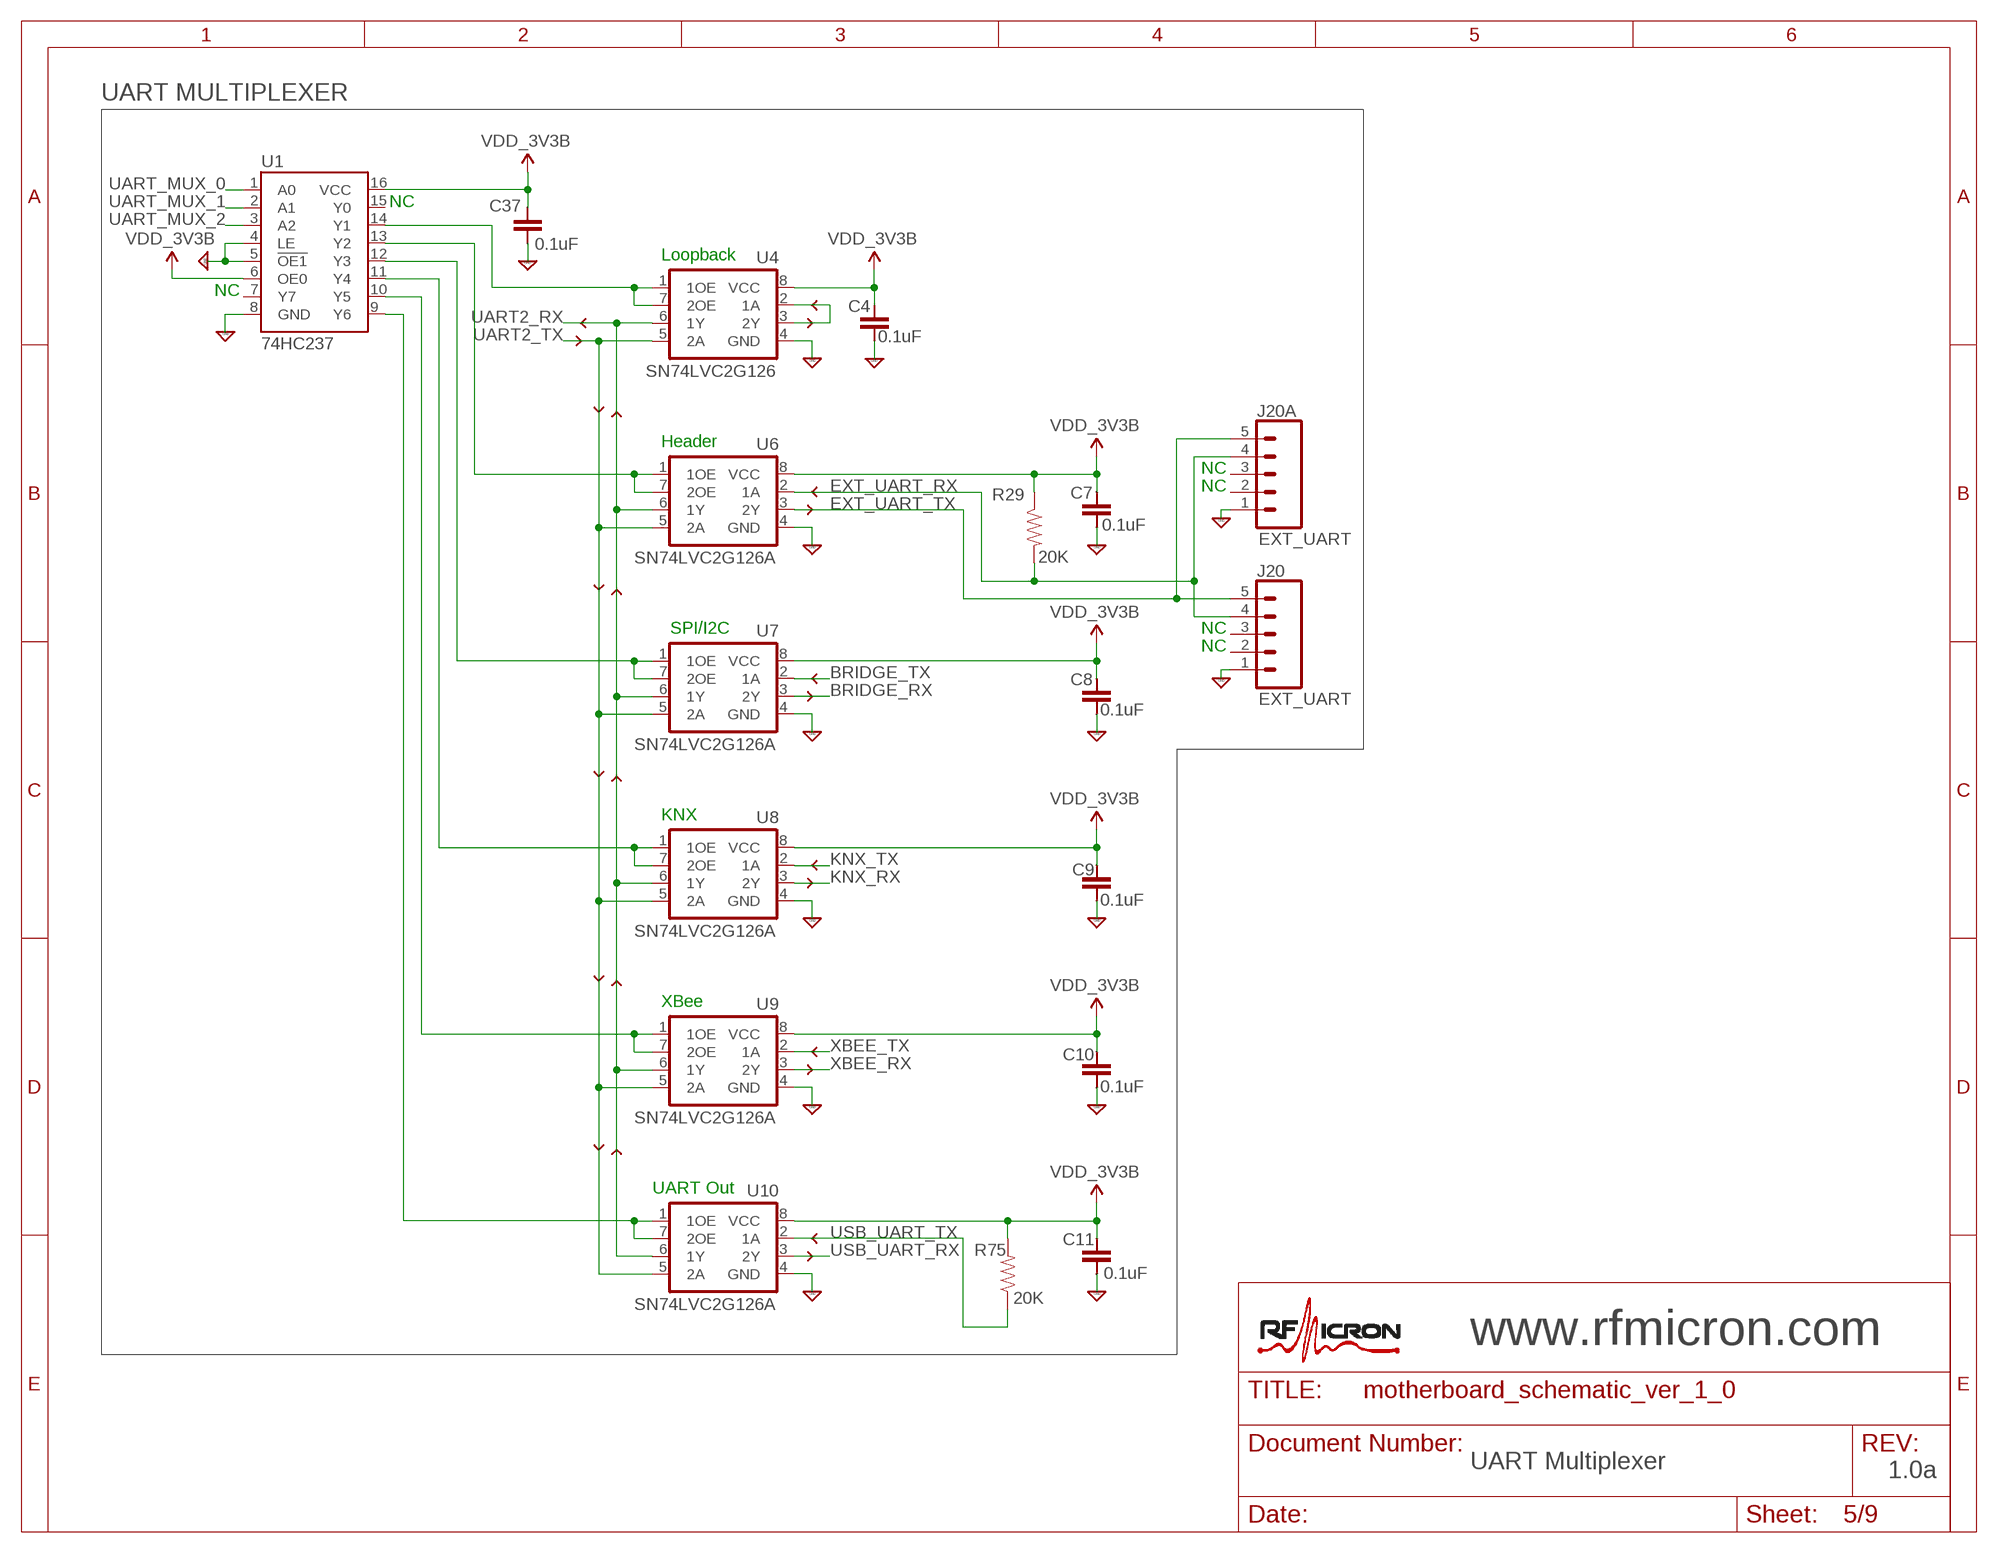
[diagram p4: schematic, sheet 5]

### Parts
C4  0.1uF  CAP0603  [0603-CAP]
C7  0.1uF  CAP0603  [0603-CAP]
C8  0.1uF  CAP0603  [0603-CAP]
C9  0.1uF  CAP0603  [0603-CAP]
C10  0.1uF  CAP0603  [0603-CAP]
C11  0.1uF  CAP0603  [0603-CAP]
C37  0.1uF  CAP0603  [0603-CAP]
J20  EXT_UART  M05PH  [PHOENIX1725685-5]
J20A  EXT_UART  M051X5  [1X05]
R29  20K  RESISTOR0603  [0603-RES]
R75  20K  RESISTOR0603  [0603-RES]
U1  74HC237  [TSSOP16]
U4  SN74LVC2G126  SN74LVC2G126A  [SM8-TI-A]
U6  SN74LVC2G126A  [SM8-TI-A]
U7  SN74LVC2G126A  [SM8-TI-A]
U8  SN74LVC2G126A  [SM8-TI-A]
U9  SN74LVC2G126A  [SM8-TI-A]
U10  SN74LVC2G126A  [SM8-TI-A]

### Nets
BRIDGE_RX: U7.3(2Y) ; also sheet 7
BRIDGE_TX: U7.2(1A) ; also sheet 7
EXT_UART_RX: J20.4 J20A.4 R29.2 U6.2(1A) ; also sheet 9
EXT_UART_TX: J20.5 J20A.5 U6.3(2Y) ; also sheet 9
GND: C4.1(+) C7.1(+) C8.1(+) C9.1(+) C10.1(+) C11.1(+) C37.2(-) J20.1 J20A.1 U1.4(LE) U1.5(!OE1) U1.8(GND) U4.4(GND) U6.4(GND) U7.4(GND) U8.4(GND) U9.4(GND) U10.4(GND) ; also sheet 2,3,4,6,7,8,9
KNX_RX: U8.3(2Y) ; also sheet 8
KNX_TX: U8.2(1A) ; also sheet 8
N$35: U4.2(1A) U4.3(2Y)
N$50: U1.14(Y1) U4.1(1OE) U4.7(2OE)
N$51: U1.13(Y2) U6.1(1OE) U6.7(2OE)
N$52: U1.12(Y3) U7.1(1OE) U7.7(2OE)
N$53: U1.11(Y4) U8.1(1OE) U8.7(2OE)
N$54: U1.10(Y5) U9.1(1OE) U9.7(2OE)
N$55: U1.9(Y6) U10.1(1OE) U10.7(2OE)
UART2_RX: U4.6(1Y) U6.6(1Y) U7.6(1Y) U8.6(1Y) U9.6(1Y) U10.6(1Y) ; also sheet 2
UART2_TX: U4.5(2A) U6.5(2A) U7.5(2A) U8.5(2A) U9.5(2A) U10.5(2A) ; also sheet 2
UART_MUX_0: U1.1(A0) ; also sheet 2
UART_MUX_1: U1.2(A1) ; also sheet 2
UART_MUX_2: U1.3(A2) ; also sheet 2
USB_UART_RX: U10.3(2Y) ; also sheet 6
USB_UART_TX: R75.1 U10.2(1A) ; also sheet 6
VDD_3V3B: C4.2(-) C7.2(-) C8.2(-) C9.2(-) C10.2(-) C11.2(-) C37.1(+) R29.1 R75.2 U1.6(OE0) U1.16(VCC) U4.8(VCC) U6.8(VCC) U7.8(VCC) U8.8(VCC) U9.8(VCC) U10.8(VCC) ; also sheet 2,3,4,6,7,8,9
XBEE_RX: U9.3(2Y) ; also sheet 6
XBEE_TX: U9.2(1A) ; also sheet 6
Unconnected: J20.2 J20.3 J20A.2 J20A.3 U1.7(Y7) U1.15(Y0)

### Notes on the sheet
- UART MULTIPLEXER
- NC
- Loopback
- NC
- Header
- NC
- NC
- SPI/I2C | NC
- NC
- KNX
- XBee
- UART Out
- www.rfmicron.com
- UART Multiplexer
- 1.0a

## Sheet 6 of 9
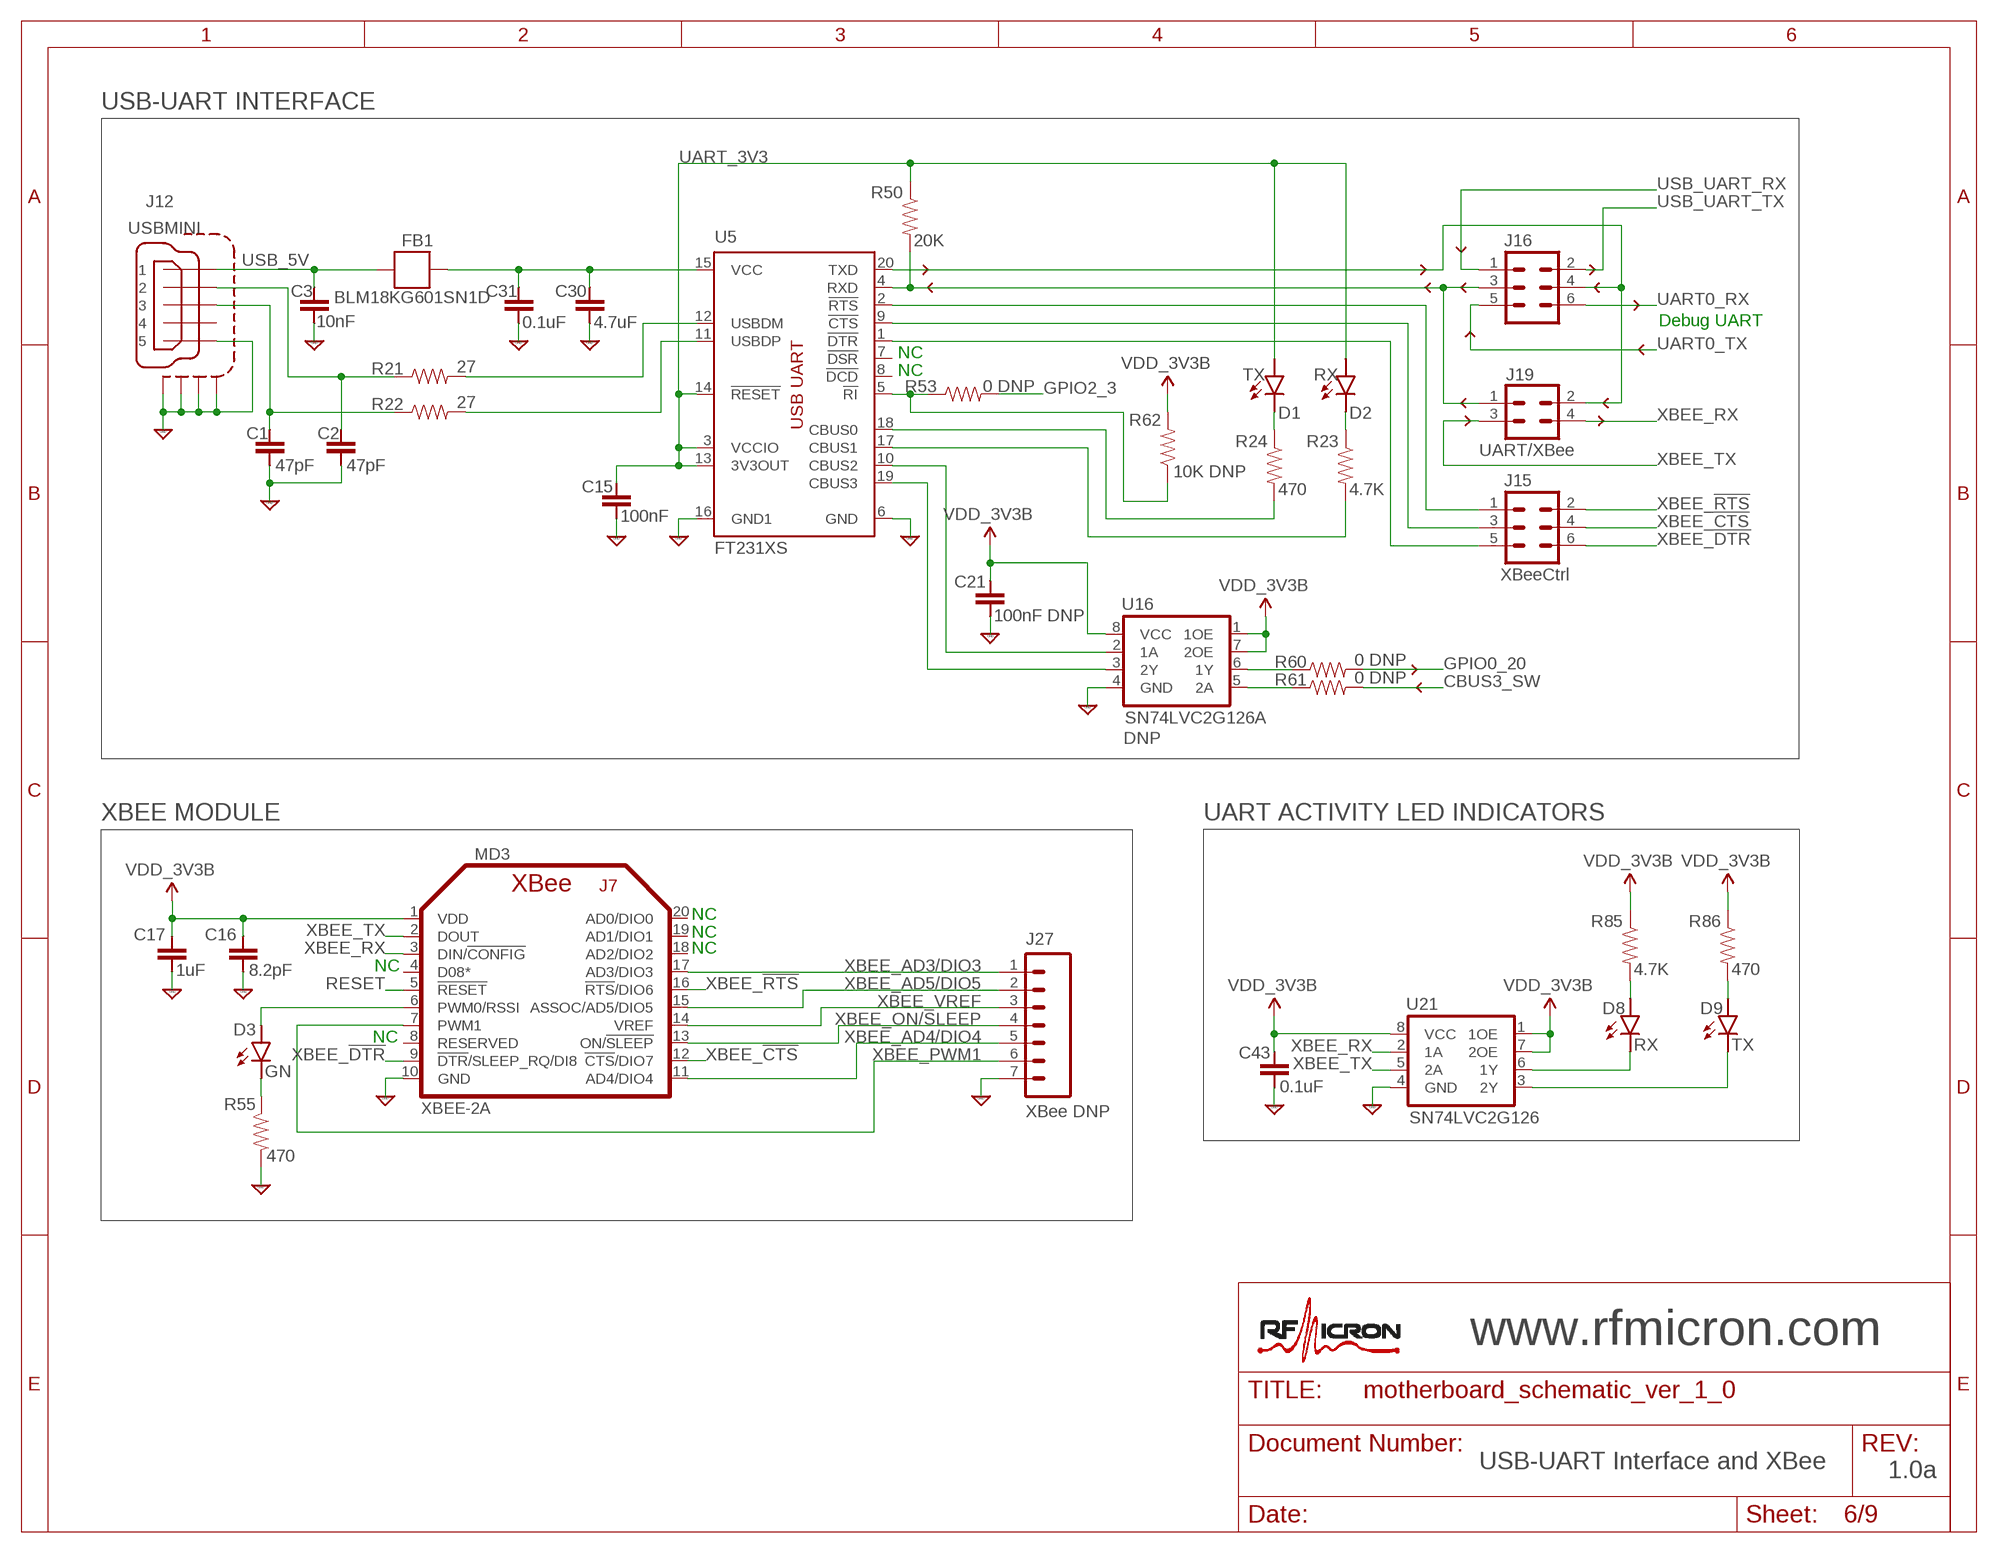
[diagram p5: schematic, sheet 6]

### Parts
C1  47pF  CAP0603  [0603-CAP]
C2  47pF  CAP0603  [0603-CAP]
C3  10nF  CAP0603  [0603-CAP]
C15  100nF  CAP0603  [0603-CAP]
C16  8.2pF  CAP0603  [0603-CAP]
C17  1uF  CAP0603  [0603-CAP]
C21  100nF DNP  CAP0603  [0603-CAP]
C30  4.7uF  CAP0603  [0603-CAP]
C31  0.1uF  CAP0603  [0603-CAP]
C43  0.1uF  CAP0603  [0603-CAP]
D1  TX  LED1206  [LED-1206]
D2  RX  LED1206  [LED-1206]
D3  GN  LED1206  [LED-1206]
D8  RX  LED1206  [LED-1206]
D9  TX  LED1206  [LED-1206]
FB1  BLM18KG601SN1D  FERRITEBEAD  [0603]
J12  USBMINI  USBMINI-32007-400TH  [USBMINI-TH]
J15  XBeeCtrl  M03X2NL  [2X3]
J16  M03X2SM  [2X3SM]
J19  UART/XBee  2X2SM  [2X2SM]
J27  XBee DNP  M07SP  [1X07-SPECIAL]
MD3  XBEE-2A  [XBEE-2]
R21  27  RESISTOR0603  [0603-RES]
R22  27  RESISTOR0603  [0603-RES]
R23  4.7K  RESISTOR0603  [0603-RES]
R24  470  RESISTOR0603  [0603-RES]
R50  20K  RESISTOR0603  [0603-RES]
R53  0 DNP  RESISTOR0603  [0603-RES]
R55  470  RESISTOR0603  [0603-RES]
R60  0 DNP  RESISTOR0603  [0603-RES]
R61  0 DNP  RESISTOR0603  [0603-RES]
R62  10K DNP  RESISTOR0603  [0603-RES]
R85  4.7K  RESISTOR0603  [0603-RES]
R86  470  RESISTOR0603  [0603-RES]
U5  FT231XS  FT231XX  [SSOP20-.150]
U16  SN74LVC2G126A  [SM8-TI-A]
U21  SN74LVC2G126  SN74LVC2G126-ALTA  [SM8-TI-A]

### Nets
!CTS: J15.3 U5.9(!CTS)
!DTR: J15.5 U5.1(!DTR)
!RTS: J15.1 U5.2(!RTS)
CBUS2: U5.10(CBUS2) U16.2(1A)
CBUS3: U5.19(CBUS3) U16.3(2Y)
CBUS3_SW: R61.2 ; also sheet 2
GND: C1.2(-) C2.2(-) C3.2(-) C15.2(-) C16.2(-) C17.2(-) C21.1(+) C30.2(-) C31.2(-) C43.1(+) J12.5 J12.6(S1) J12.7(S2) J12.8(S3) J12.9(S4) J27.7 MD3.10(GND) R55.2 U5.6(GND) U5.16(GND1) U16.4(GND) U21.4(GND) ; also sheet 2,3,4,5,7,8,9
GPIO0_20: R60.2 ; also sheet 2,9
GPIO2_3: R53.2 ; also sheet 2,9
N$22: R21.2 U5.12(USBDM)
N$23: R22.2 U5.11(USBDP)
N$24: R61.1 U16.5(2A)
N$25: C2.1(+) J12.2 R21.1
N$27: C1.1(+) J12.3 R22.1
N$28: C30.1(+) C31.1(+) FB1.1 U5.15(VCC)
N$29: D3.C R55.1
N$30: D1.C R24.1
N$31: D2.C R23.1
N$32: D3.A MD3.6(PWM0/RSSI)
N$42: R23.2 U5.17(CBUS1)
N$43: R53.1 R62.1 U5.5(!RI)
N$44: R24.2 U5.18(CBUS0)
N$46: D8.A R85.2
N$59: J16.3 J19.1 R50.2 U5.4(RXD)
N$61: D9.A R86.2
N$62: D8.C U21.6(1Y)
N$63: R60.1 U16.6(1Y)
N$65: D9.C U21.3(2Y)
N$70: J16.4 J19.2 U5.20(TXD)
RESET: MD3.5(!RESET) ; also sheet 2,7
UART0_RX: J16.6 ; also sheet 2
UART0_TX: J16.5 ; also sheet 2
UART_3V3: C15.1(+) D1.A D2.A R50.1 U5.3(VCCIO) U5.13(3V3OUT) U5.14(!RESET)
USB_5V: C3.1(+) FB1.2 J12.1
USB_UART_RX: J16.1 ; also sheet 5
USB_UART_TX: J16.2 ; also sheet 5
VDD_3V3B: C16.1(+) C17.1(+) C21.2(-) C43.2(-) MD3.1(VDD) R62.2 R85.1 R86.1 U16.1(1OE) U16.7(2OE) U16.8(VCC) U21.1(1OE) U21.7(2OE) U21.8(VCC) ; also sheet 2,3,4,5,7,8,9
XBEE_!CTS: J15.4 MD3.12(!CTS!/DIO7)
XBEE_!DTR: J15.6 MD3.9(!DTR!/SLEEP_RQ/DI8)
XBEE_!RTS: J15.2 MD3.16(!RTS!/DIO6)
XBEE_AD3/DIO3: J27.1 MD3.17(AD3/DIO3)
XBEE_AD4/DIO4: J27.5 MD3.11(AD4/DIO4)
XBEE_AD5/DIO5: J27.2 MD3.15(ASSOC/AD5/DIO5)
XBEE_ON/SLEEP: J27.4 MD3.13(ON/!SLEEP)
XBEE_PWM1: J27.6 MD3.7(PWM1)
XBEE_RX: J19.4 MD3.3(DIN/!CONFIG) U21.2(1A) ; also sheet 5
XBEE_TX: J19.3 MD3.2(DOUT) U21.5(2A) ; also sheet 5
XBEE_VREF: J27.3 MD3.14(VREF)
Unconnected: J12.4 MD3.4(D08*) MD3.8(RESERVED) MD3.18(AD2/DIO2) MD3.19(AD1/DIO1) MD3.20(AD0/DIO0) U5.7(!DSR) U5.8(!DCD)

### Notes on the sheet
- USB-UART INTERFACE
- Debug UART
- NC
- NC
- DNP
- XBEE MODULE | UART ACTIVITY LED INDICATORS
- NC
- NC
- NC
- NC
- NC
- www.rfmicron.com
- USB-UART Interface and XBee
- 1.0a

## Sheet 7 of 9
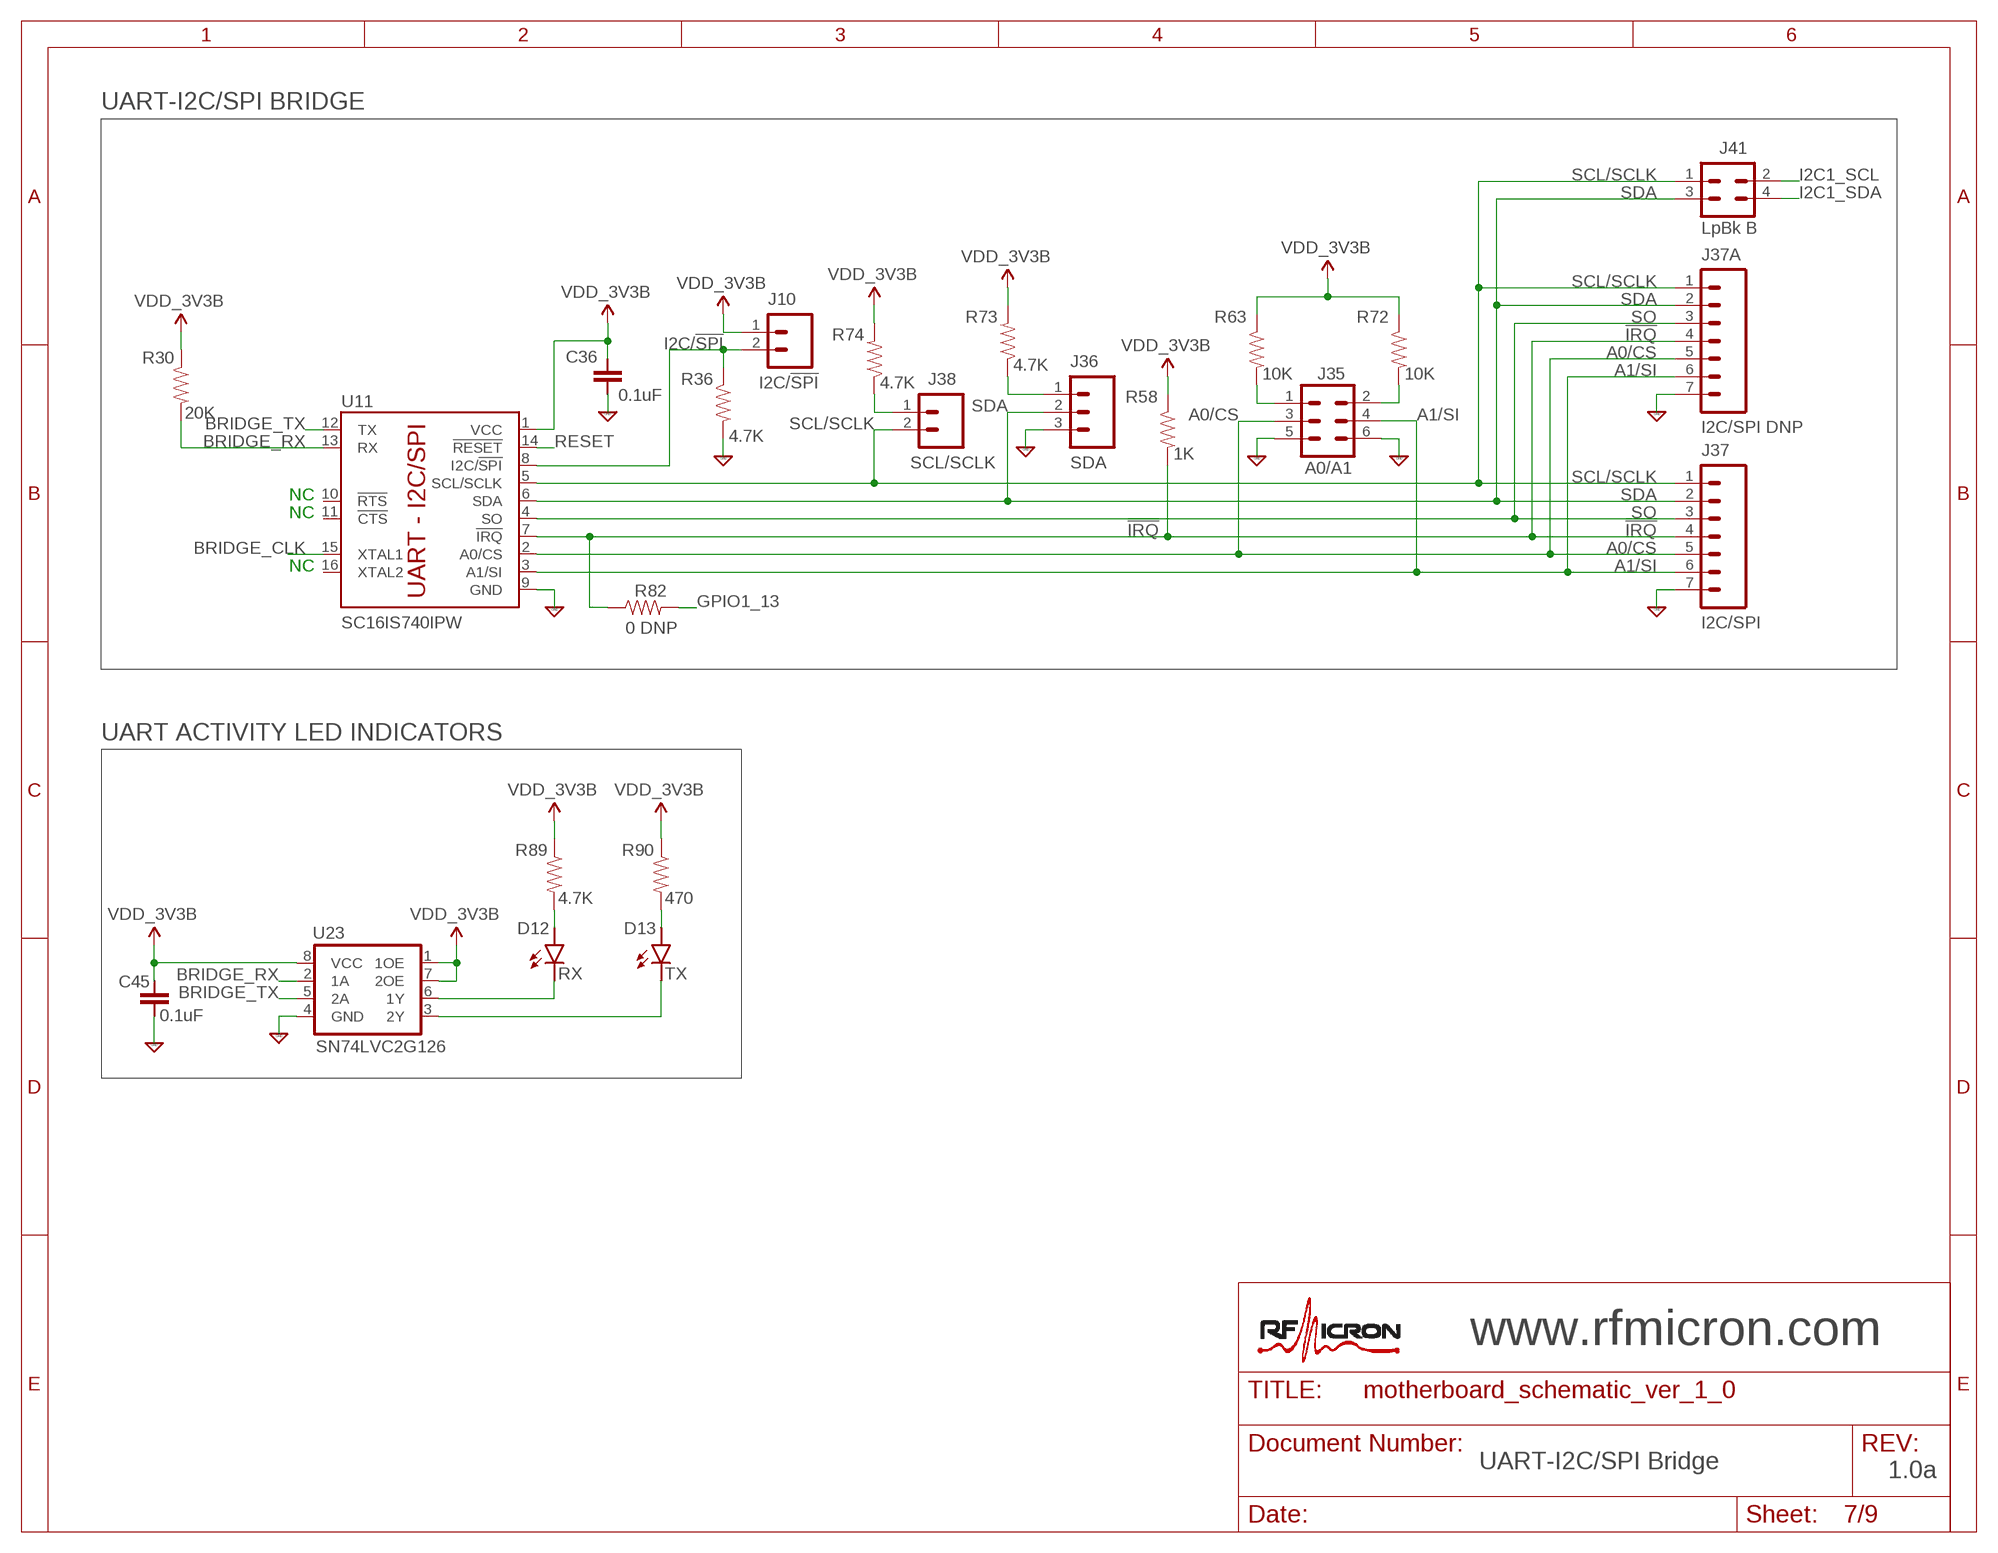
[diagram p6: schematic, sheet 7]

### Parts
C36  0.1uF  CAP0603  [0603-CAP]
C45  0.1uF  CAP0603  [0603-CAP]
D12  RX  LED1206  [LED-1206]
D13  TX  LED1206  [LED-1206]
J10  I2C/!SPI  M02ATH  [1X2]
J35  A0/A1  M03X2SM  [2X3SM]
J36  SDA  M03SP  [1X03-SPECIAL]
J37  I2C/SPI  M07PH  [PHOENIX1725708-7]
J37A  I2C/SPI DNP  M07SP  [1X07-SPECIAL]
J38  SCL/SCLK  M02ATH  [1X2]
J41  LpBk B  2X2SM  [2X2SM]
R30  20K  RESISTOR0603  [0603-RES]
R36  4.7K  RESISTOR0603  [0603-RES]
R58  1K  RESISTOR0603  [0603-RES]
R63  10K  RESISTOR0603  [0603-RES]
R72  10K  RESISTOR0603  [0603-RES]
R73  4.7K  RESISTOR0603  [0603-RES]
R74  4.7K  RESISTOR0603  [0603-RES]
R82  0 DNP  RESISTOR0603  [0603-RES]
R89  4.7K  RESISTOR0603  [0603-RES]
R90  470  RESISTOR0603  [0603-RES]
U11  SC16IS740IPW  [TSSOP16]
U23  SN74LVC2G126  SN74LVC2G126-ALTA  [SM8-TI-A]

### Nets
!IRQ: J37.4 J37A.4 R58.2 R82.1 U11.7(!IRQ)
A0/CS: J35.3 J37.5 J37A.5 U11.2(A0/CS) ; also sheet 9
A1/SI: J35.4 J37.6 J37A.6 U11.3(A1/SI) ; also sheet 9
BRIDGE_CLK: U11.15(XTAL1) ; also sheet 2
BRIDGE_RX: R30.2 U11.13(RX) U23.2(1A) ; also sheet 5
BRIDGE_TX: U11.12(TX) U23.5(2A) ; also sheet 5
GND: C36.2(-) C45.1(+) J35.5 J35.6 J36.3 J37.7 J37A.7 R36.2 U11.9(GND) U23.4(GND) ; also sheet 2,3,4,5,6,8,9
GPIO1_13: R82.2 ; also sheet 2,3,9
I2C1_SCL: J41.2 ; also sheet 2,9
I2C1_SDA: J41.4 ; also sheet 2,9
I2C/!SPI: J10.2 R36.1 U11.8(I2C/!SPI)
N$49: J38.1 R74.1
N$80: J36.1 R73.1
N$90: J35.1 R63.2
N$102: J35.2 R72.2
N$103: D12.A R89.2
N$104: D13.A R90.2
N$105: D12.C U23.6(1Y)
N$107: D13.C U23.3(2Y)
RESET: U11.14(!RESET) ; also sheet 2,6
SCL/SCLK: J37.1 J37A.1 J38.2 J41.1 U11.5(SCL/SCLK) ; also sheet 9
SDA: J36.2 J37.2 J37A.2 J41.3 U11.6(SDA)
SO: J37.3 J37A.3 U11.4(SO) ; also sheet 9
VDD_3V3B: C36.1(+) C45.2(-) J10.1 R30.1 R58.1 R63.1 R72.1 R73.2 R74.2 R89.1 R90.1 U11.1(VCC) U23.1(1OE) U23.7(2OE) U23.8(VCC) ; also sheet 2,3,4,5,6,8,9
Unconnected: U11.10(!RTS) U11.11(!CTS) U11.16(XTAL2)

### Notes on the sheet
- UART-I2C/SPI BRIDGE
- NC
- NC
- NC
- UART ACTIVITY LED INDICATORS
- www.rfmicron.com
- UART-I2C/SPI Bridge
- 1.0a

## Sheet 8 of 9
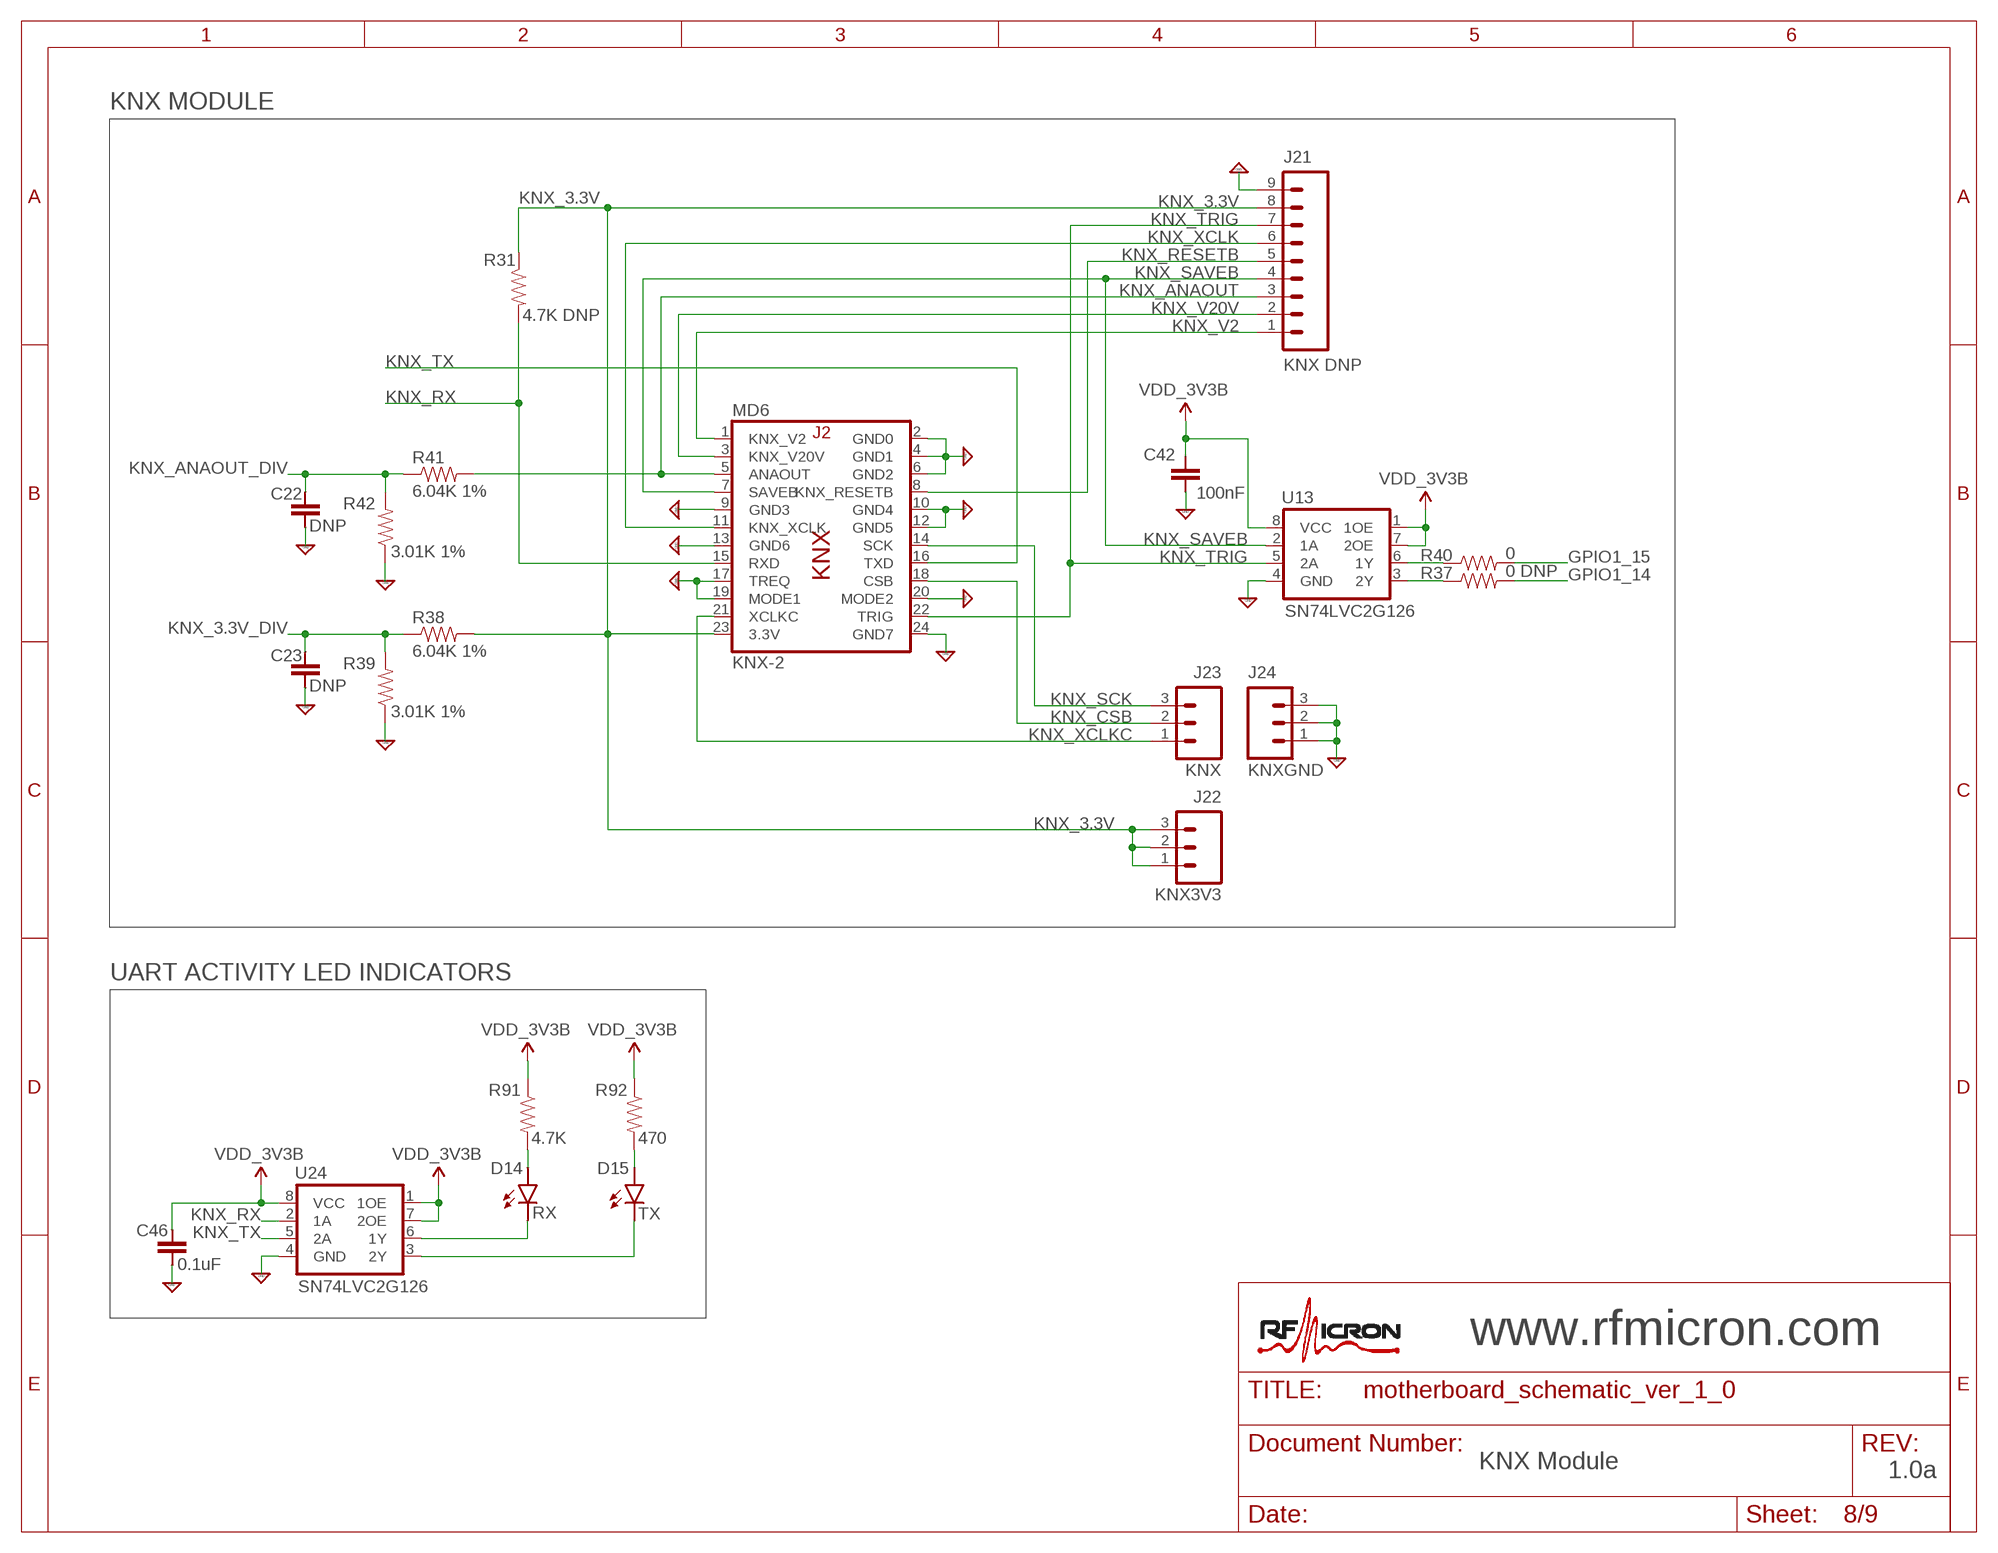
[diagram p7: schematic, sheet 8]

### Parts
C22  DNP  CAP0603  [0603-CAP]
C23  DNP  CAP0603  [0603-CAP]
C42  100nF  CAP0603  [0603-CAP]
C46  0.1uF  CAP0603  [0603-CAP]
D14  RX  LED1206  [LED-1206]
D15  TX  LED1206  [LED-1206]
J21  KNX DNP  M09SPECIAL  [1X09-SPECIAL]
J22  KNX3V3  M03SP  [1X03-SPECIAL]
J23  KNX  M03SP  [1X03-SPECIAL]
J24  KNXGND  M03SP  [1X03-SPECIAL]
MD6  KNX-2  [KNX-1]
R31  4.7K DNP  RESISTOR0603  [0603-RES]
R37  0 DNP  RESISTOR0603  [0603-RES]
R38  6.04K 1%  RESISTOR0603  [0603-RES]
R39  3.01K 1%  RESISTOR0603  [0603-RES]
R40  0  RESISTOR0603  [0603-RES]
R41  6.04K 1%  RESISTOR0603  [0603-RES]
R42  3.01K 1%  RESISTOR0603  [0603-RES]
R91  4.7K  RESISTOR0603  [0603-RES]
R92  470  RESISTOR0603  [0603-RES]
U13  SN74LVC2G126  SN74LVC2G126-ALTA  [SM8-TI-A]
U24  SN74LVC2G126  SN74LVC2G126-ALTA  [SM8-TI-A]

### Nets
GND: C22.2(-) C23.2(-) C42.2(-) C46.1(+) J21.9 J24.1 J24.2 J24.3 MD6.2(GND0) MD6.4(GND1) MD6.6(GND2) MD6.9(GND3) MD6.10(GND4) MD6.12(GND5) MD6.13(GND6) MD6.17(TREQ) MD6.19(MODE1) MD6.20(MODE2) MD6.24(GND7) R39.1 R42.1 U13.4(GND) U24.4(GND) ; also sheet 2,3,4,5,6,7,9
GPIO1_14: R37.2 ; also sheet 2,9
GPIO1_15: R40.2 ; also sheet 2,9
KNX_3.3V: J21.8 J22.1 J22.2 J22.3 MD6.23(3.3V) R31.1 R38.2
KNX_3.3V_DIV: C23.1(+) R38.1 R39.2 ; also sheet 2
KNX_ANAOUT: J21.3 MD6.5(ANAOUT) R41.2
KNX_ANAOUT_DIV: C22.1(+) R41.1 R42.2 ; also sheet 2
KNX_CSB: J23.2 MD6.18(CSB)
KNX_RESETB: J21.5 MD6.8(KNX_RESETB)
KNX_RX: MD6.15(RXD) R31.2 U24.2(1A) ; also sheet 5
KNX_SAVEB: J21.4 MD6.7(SAVEB) U13.2(1A)
KNX_SCK: J23.3 MD6.14(SCK)
KNX_TRIG: J21.7 MD6.22(TRIG) U13.5(2A)
KNX_TX: MD6.16(TXD) U24.5(2A) ; also sheet 5
KNX_V2: J21.1 MD6.1(KNX_V2)
KNX_V20V: J21.2 MD6.3(KNX_V20V)
KNX_XCLK: J21.6 MD6.11(KNX_XCLK)
KNX_XCLKC: J23.1 MD6.21(XCLKC)
N$77: R40.1 U13.6(1Y)
N$79: R37.1 U13.3(2Y)
N$110: D14.A R91.2
N$111: D15.A R92.2
N$112: D14.C U24.6(1Y)
N$113: D15.C U24.3(2Y)
VDD_3V3B: C42.1(+) C46.2(-) R91.1 R92.1 U13.1(1OE) U13.7(2OE) U13.8(VCC) U24.1(1OE) U24.7(2OE) U24.8(VCC) ; also sheet 2,3,4,5,6,7,9

### Notes on the sheet
- KNX MODULE
- UART ACTIVITY LED INDICATORS
- www.rfmicron.com
- KNX Module
- 1.0a

## Sheet 9 of 9
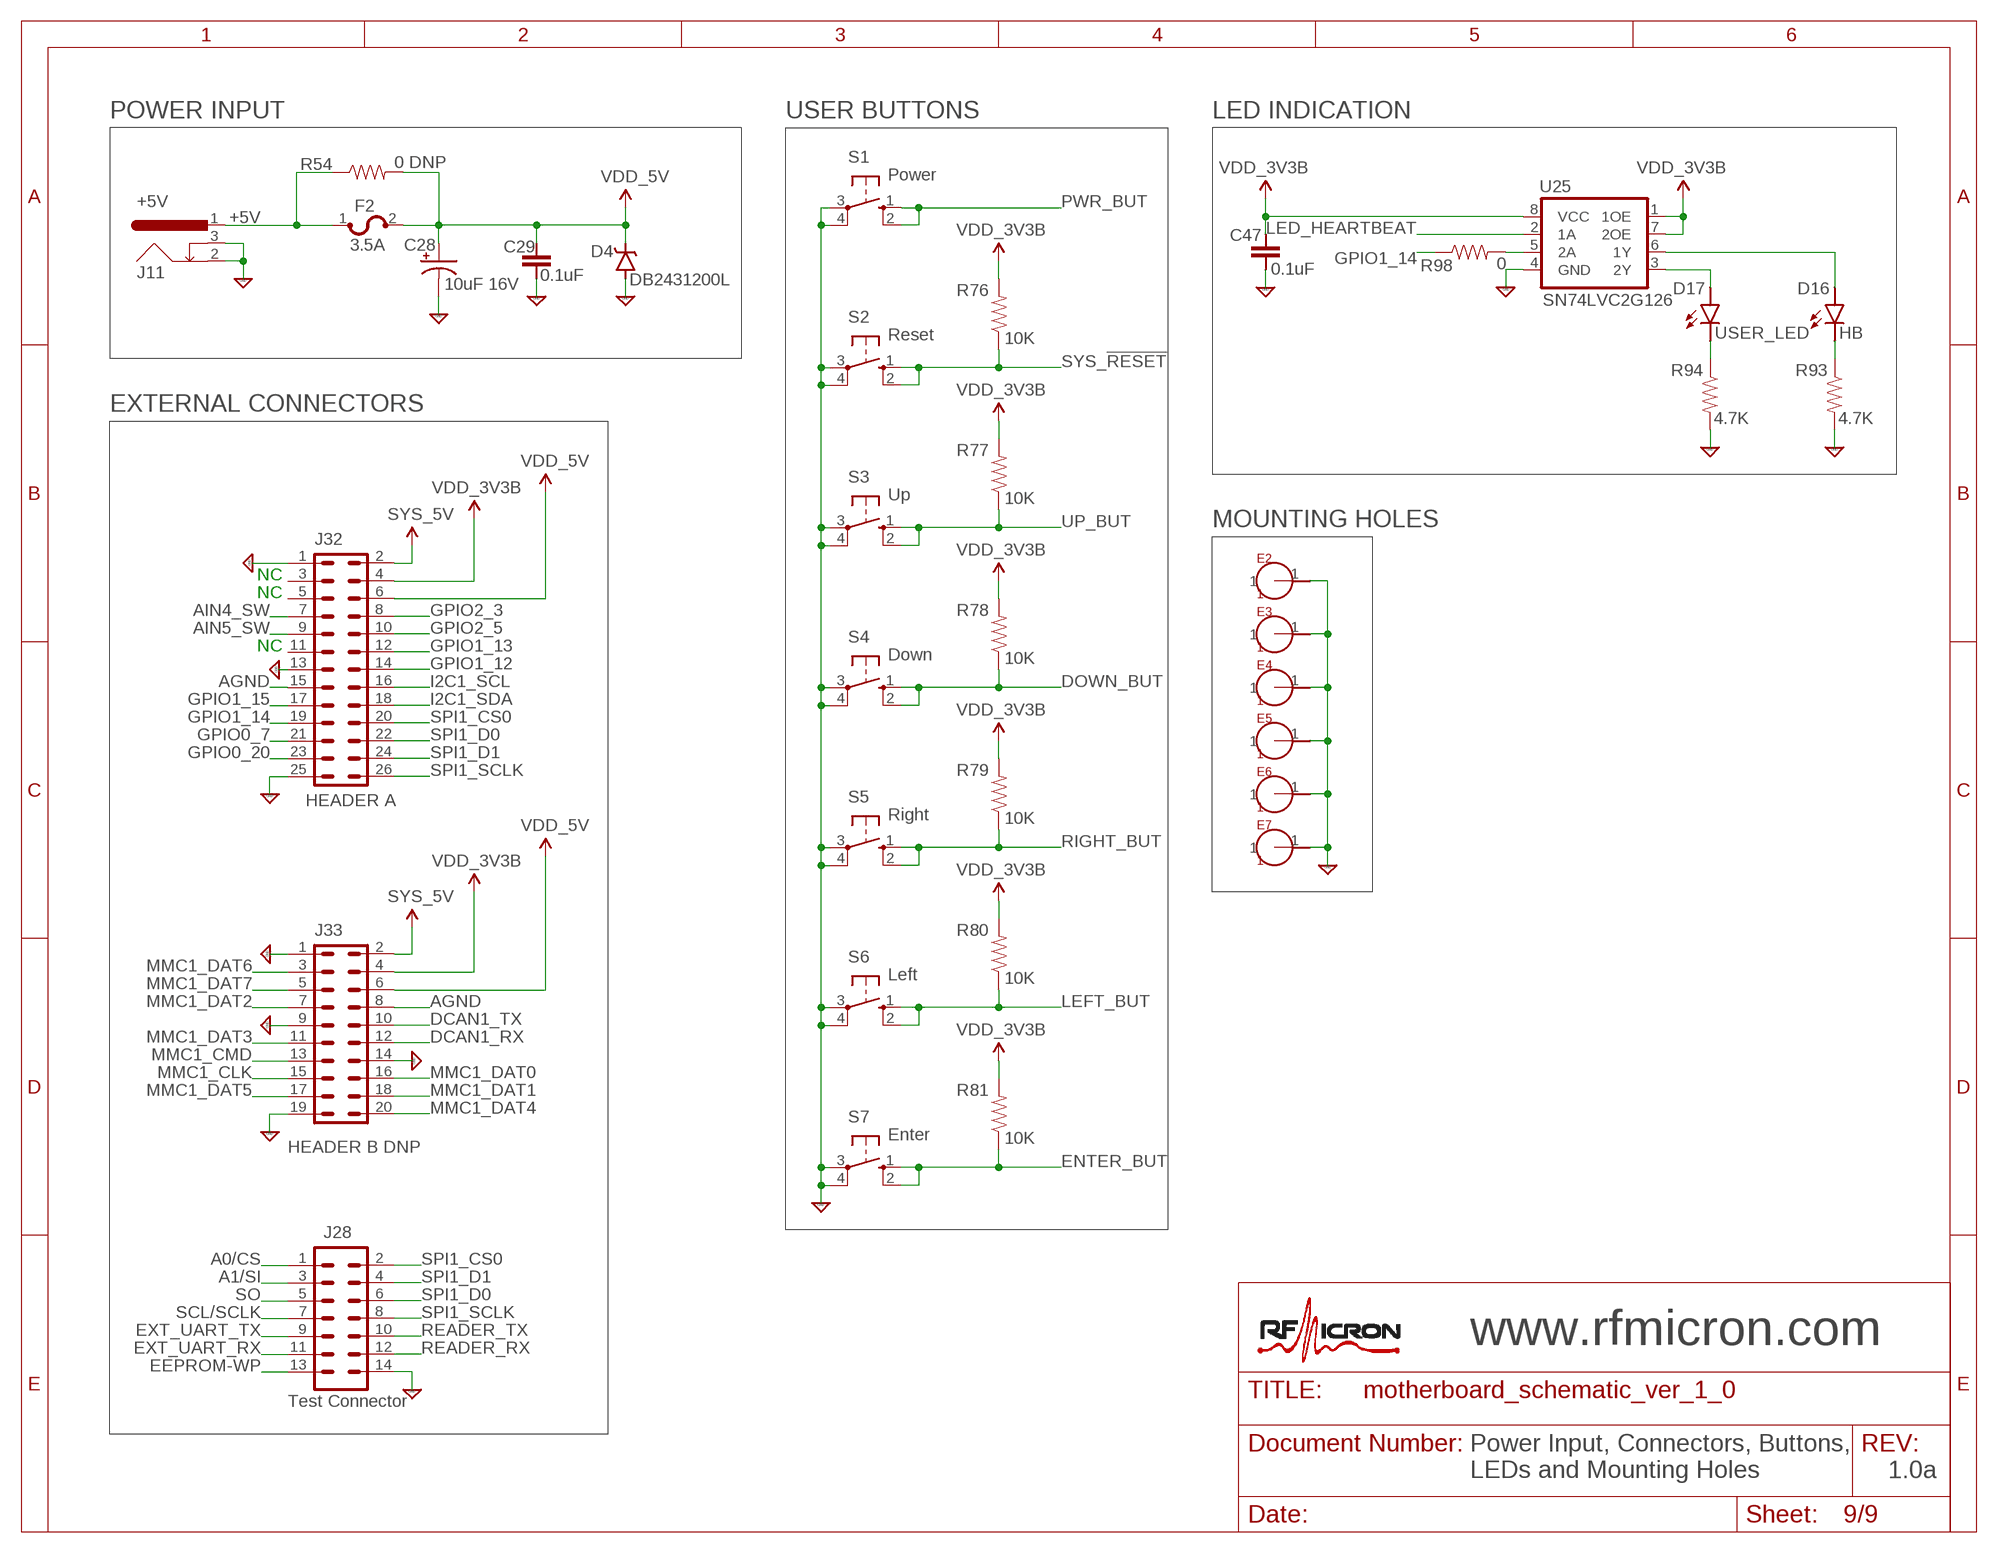
[diagram p8: schematic, sheet 9]

### Parts
C28  10uF 16V  CAP_POL1206  [EIA3216]
C29  0.1uF  CAP0603  [0603-CAP]
C47  0.1uF  CAP0603  [0603-CAP]
D4  DB2431200L  DIODE-SCHOTTKY3  [SC-110A-POWER_DIODE]
D16  HB  LED1206  [LED-1206]
D17  USER_LED  LED1206  [LED-1206]
E2  1  HOLE-MOUNT1  [MTHOLE4-40]
E3  1  HOLE-MOUNT1  [MTHOLE4-40]
E4  1  HOLE-MOUNT1  [MTHOLE4-40]
E5  1  HOLE-MOUNT1  [MTHOLE4-40]
E6  1  HOLE-MOUNT1  [MTHOLE4-40]
E7  1  HOLE-MOUNT1  [MTHOLE4-40]
F2  3.5A  FUSE_OMNI-BLOCK-154-SM  [FUSE_OMNI-BLOCK-154]
J11  +5V  POWER_JACKPTH  [POWER_JACK_PTH]
J28  Test Connector  M2X7SM  [2X7SM]
J32  HEADER A  M2X13SM  [2X13-SM]
J33  HEADER B DNP  M10X2SM  [2X10SM]
R54  0 DNP  RESISTOR1206  [1206]
R76  10K  RESISTOR0603  [0603-RES]
R77  10K  RESISTOR0603  [0603-RES]
R78  10K  RESISTOR0603  [0603-RES]
R79  10K  RESISTOR0603  [0603-RES]
R80  10K  RESISTOR0603  [0603-RES]
R81  10K  RESISTOR0603  [0603-RES]
R93  4.7K  RESISTOR0603  [0603-RES]
R94  4.7K  RESISTOR0603  [0603-RES]
R98  0  RESISTOR0603  [0603-RES]
S1  Power  10-XXT  [EVQ-PAC04M]
S2  Reset  10-XXT  [EVQ-PAC04M]
S3  Up  10-XXT  [EVQ-PAC04M]
S4  Down  10-XXT  [EVQ-PAC04M]
S5  Right  10-XXT  [EVQ-PAC04M]
S6  Left  10-XXT  [EVQ-PAC04M]
S7  Enter  10-XXT  [EVQ-PAC04M]
U25  SN74LVC2G126  SN74LVC2G126-ALTA  [SM8-TI-A]

### Nets
+5V: F2.1 J11.1(PWR) R54.1
A0/CS: J28.1 ; also sheet 7
A1/SI: J28.3 ; also sheet 7
AGND: J32.15 J33.8 ; also sheet 2
AIN4_SW: J32.7 ; also sheet 2
AIN5_SW: J32.9 ; also sheet 2
DCAN1_RX: J33.12 ; also sheet 2,3
DCAN1_TX: J33.10 ; also sheet 2,3
DOWN_BUT: R78.1 S4.1(S) S4.2(S1) ; also sheet 2
EEPROM-WP: J28.13 ; also sheet 3
ENTER_BUT: R81.1 S7.1(S) S7.2(S1) ; also sheet 2
EXT_UART_RX: J28.11 ; also sheet 5
EXT_UART_TX: J28.9 ; also sheet 5
GND: C28.C(-) C29.2(-) C47.1(+) D4.A E2.1 E3.1 E4.1 E5.1 E6.1 E7.1 J11.2(GND) J11.3(GNDBREAK) J28.14 J32.1 J32.13 J32.25 J33.1 J33.9 J33.14 J33.19 R93.2 R94.2 S1.3(P) S1.4(P1) S2.3(P) S2.4(P1) S3.3(P) S3.4(P1) S4.3(P) S4.4(P1) S5.3(P) S5.4(P1) S6.3(P) S6.4(P1) S7.3(P) S7.4(P1) U25.4(GND) ; also sheet 2,3,4,5,6,7,8
GPIO0_7: J32.21 ; also sheet 2,4
GPIO0_20: J32.23 ; also sheet 2,6
GPIO1_12: J32.14 ; also sheet 2,3
GPIO1_13: J32.12 ; also sheet 2,3,7
GPIO1_14: J32.19 R98.1 ; also sheet 2,8
GPIO1_15: J32.17 ; also sheet 2,8
GPIO2_3: J32.8 ; also sheet 2,6
GPIO2_5: J32.10 ; also sheet 2,3
I2C1_SCL: J32.16 ; also sheet 2,7
I2C1_SDA: J32.18 ; also sheet 2,7
LED_HEARTBEAT: U25.2(1A) ; also sheet 2
LEFT_BUT: R80.1 S6.1(S) S6.2(S1) ; also sheet 2
MMC1_CLK: J33.15 ; also sheet 2
MMC1_CMD: J33.13 ; also sheet 2
MMC1_DAT0: J33.16 ; also sheet 2
MMC1_DAT1: J33.18 ; also sheet 2
MMC1_DAT2: J33.7 ; also sheet 2
MMC1_DAT3: J33.11 ; also sheet 2
MMC1_DAT4: J33.20 ; also sheet 2
MMC1_DAT5: J33.17 ; also sheet 2
MMC1_DAT6: J33.3 ; also sheet 2
MMC1_DAT7: J33.5 ; also sheet 2
N$40: D16.C R93.1
N$67: D17.C R94.1
N$100: R98.2 U25.5(2A)
N$118: D16.A U25.6(1Y)
N$119: D17.A U25.3(2Y)
PWR_BUT: S1.1(S) S1.2(S1) ; also sheet 2
READER_RX: J28.12 ; also sheet 2,4
READER_TX: J28.10 ; also sheet 2,4
RIGHT_BUT: R79.1 S5.1(S) S5.2(S1) ; also sheet 2
SCL/SCLK: J28.7 ; also sheet 7
SO: J28.5 ; also sheet 7
SPI1_CS0: J28.2 J32.20 ; also sheet 2
SPI1_D0: J28.6 J32.22 ; also sheet 2
SPI1_D1: J28.4 J32.24 ; also sheet 2
SPI1_SCLK: J28.8 J32.26 ; also sheet 2
SYS_5V: J32.2 J33.2 ; also sheet 2,3,4
SYS_!RESET: R76.1 S2.1(S) S2.2(S1) ; also sheet 2
UP_BUT: R77.1 S3.1(S) S3.2(S1) ; also sheet 2
VDD_3V3B: C47.2(-) J32.4 J33.4 R76.2 R77.2 R78.2 R79.2 R80.2 R81.2 U25.1(1OE) U25.7(2OE) U25.8(VCC) ; also sheet 2,3,4,5,6,7,8
VDD_5V: C28.A(+) C29.1(+) D4.C F2.2 J32.6 J33.6 R54.2 ; also sheet 2,4
Unconnected: J32.3 J32.5 J32.11

### Notes on the sheet
- POWER INPUT | USER BUTTONS | LED INDICATION
- EXTERNAL CONNECTORS
- MOUNTING HOLES
- NC
- NC
- NC
- www.rfmicron.com
- Power Input, Connectors, Buttons,
  LEDs and Mounting Holes
- 1.0a

## Library data of the parts
C1-C27 C29-C49 = !!TELI_COMP:CAP
C28 = !!TELI_COMP:CAP_POL: Capacitor Polarized These are standard SMD and PTH capacitors. Normally 10uF, 47uF, and 100uF in electrolytic and tantalum varieties. Always verify the external diameter of the through hole cap, it varies with capacity, voltage, and manufacturer. The EIA devices should be standard.
D1-D3 D6 D8-D17 = !!TELI_LED:LED
D4 D5 = !!TELI_SEMI:DIODE-SCHOTTKY
E1 E8 = hermes_lib_1.0:NAMECHANGE
E2-E7 = !!TELI_CONN:HOLE-MOUNT: Moounting hole for 4-40 screw
F2 = !!TELI_COMP:FUSE_OMNI-BLOCK-154-SM
FB1 FB2 = !!TELI_COMP:FERRITEBEAD
J10 J25 J38 = !!TELI_CONN:M02A
J11 = !!TELI_CONN:POWER_JACK: Power Jack This is the standard 5.5mm barrel jack for power. The PTH is the most common, proven, reliable, footprint. All others are experimental. The Slot footprint only works if the mill layer is transmitted to the PCB fab house so be warned. Spark Fun Electronics SKU : PRT-00119. Mating wall wart : TOL-00298 (and others)
J12 = !!TELI_CONN:USBMINI-32007-400
J13 J14 = !!TELI_CONN_RF:SMB-SMD
J15 J16 J35 = !!TELI_CONN:M03X2
J17 J18 = !!TELI_CONN_RF:BNC-SMA-EDGE
J19 J41 = !!TELI_CONN:2X2
J20 J20A = !!TELI_CONN:M05
J21 J30 = !!TELI_CONN:M09
J22-J24 J31 J34 J34A J36 = !!TELI_CONN:M03
J27 J29 J37 J37A = !!TELI_CONN:M07
J28 = !!TELI_CONN:M2X7
J32 = !!TELI_CONN:M2X13
J33 = !!TELI_CONN:M10X2: This was SPECIALLY designed to be used with our Graphic LCD Backpack. Be sure you want to use this! It is not only staggered on each line of header holes, but IT IS ALSO offset of the center point of the top and bottom lines by 5 mil. This causes the headers to lock into place on the "standard" footprint on the LCD screen. The extra squares on the tdocu layer are there simply to reference other pins (if you were to actually populate a longer header than ten long - this is what we do with the backpacks).
J40 = !!TELI_CONN:M06: Header 6 Standard 6-pin 0.1" header. Use with straight break away headers (SKU : PRT-00116), right angle break away headers (PRT-00553), swiss pins (PRT-00743), machine pins (PRT-00117), and female headers (PRT-00115). Molex polarized connector foot print use with SKU : PRT-08094 with associated crimp pins and housings. NOTES ON THE VARIANTS LOCK and LOCK_LONGPADS... This footprint was designed to help hold the alignment of a through-hole component (i.e. 6-pin header) while soldering it into place. You may notice that each hole has been shifted either up or down by 0.005 of an inch from it's more standard position (which is a perfectly straight line). This slight alteration caused the pins (the squares in the middle) to touch the edges of the holes. Because they are alternating, it causes a "brace" to hold the component in place. 0.005 has proven to be the perfect amount of "off-center" position when using our standard breakaway headers. Although looks a little odd when you look at the bare footprint, once you have a header in there, the alteration is very hard to notice. Also, if you push a header all the way into place, it is covered up entirely on the bottom side. This idea of altering the position of holes to aid alignment will be further integrated into the Sparkfun Library for other footprints. It can help hold any component with 3 or more connection pins.
L1 = !!TELI_MAG:TDK-CA_INDUCT
MD1 = !!TELI_Module:BBONE_BK
MD2 = !!TELI_Module:NEWHAVEN_LCD_NHD-7.0-800480EF
MD3 = !!TELI_Module:XBEE-2
MD5 = !!TELI_Module:RADON_RFID_READ
MD6 = !!TELI_Module:KNX-2
R1-R63 R66-R99 = !!TELI_COMP:RESISTOR
R64 R65 = !!TELI_COMP:RESISTOR_4-TERM: Resistor current monitor 4-terminal
S1-S7 = !!TELI_SWITCH:10-XX: OMRON SWITCH
U1 = !!TELI_IC:74HC237
U2 = !!TELI_IC:CAT4139
U3 = !!TELI_IC:NCV7342
U4 U6-U10 U16 = !!TELI_IC:SN74LVC2G126
U5 = !!TELI_IC:FT231X
U11 = !!TELI_IC:SC16IS740IPW
U12 = !!TELI_IC:EEPROM-I2C: I2C EEPROM chips, 24LC256 (and others)
U13 U21-U25 = !!TELI_IC:SN74LVC2G126-ALT
U14 U15 = !!TELI_IC:ADG4612
U17 = !!TELI_IC:IL712
U18 U19 = !!TELI_IC:INA225: Current monitor
U20 = !!TELI_IC:TPS22958POWERSWITCH